# EAGLE design cpu-68008 (EAGLE 9.4.2)

## Sheet 1 of 3: CPU, RAM, ROM
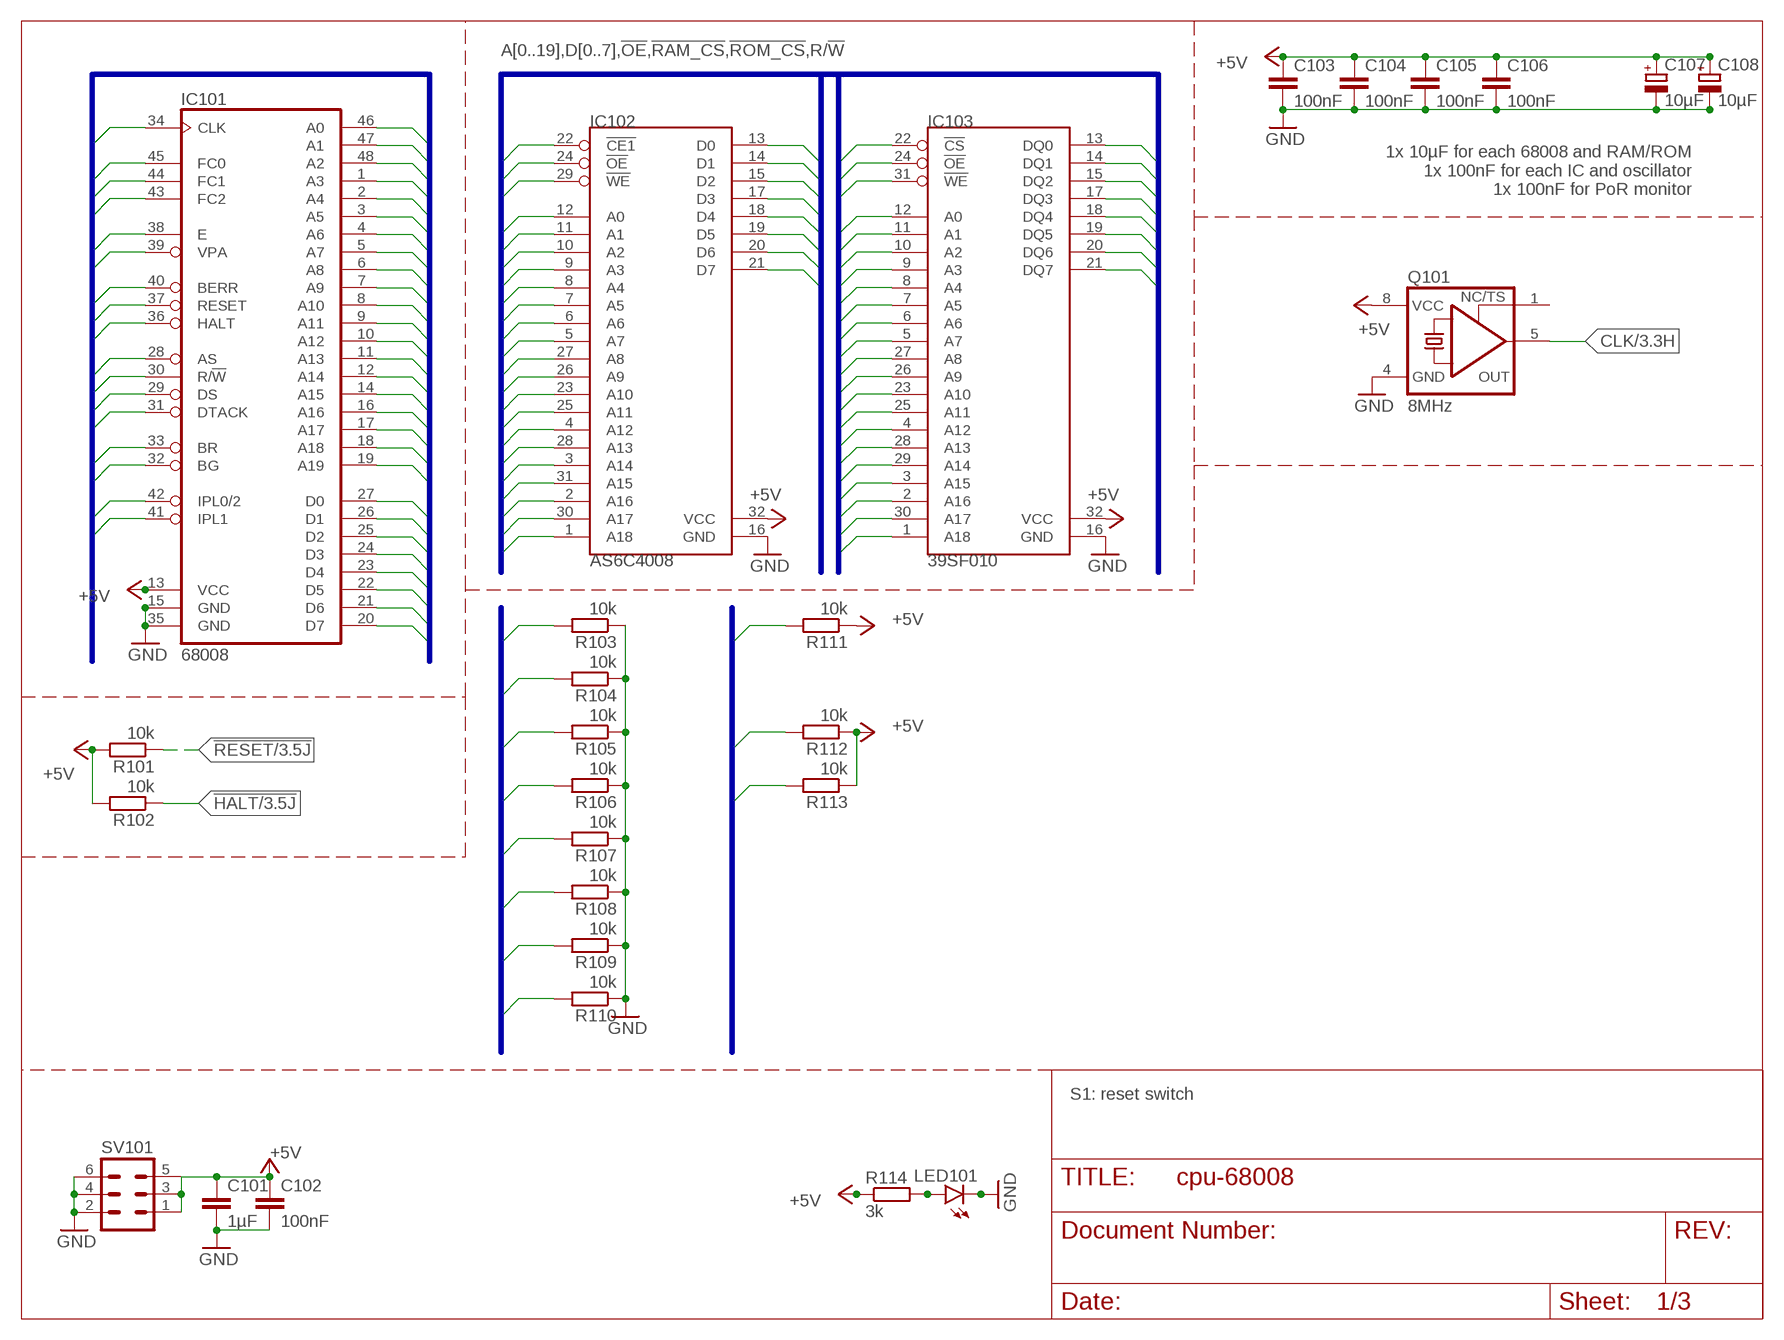
[diagram p0: schematic, sheet 1]

### Parts
C101  1µF  C-EUC0805  [C0805]
C102  100nF  C-EUC0805  [C0805]
C103  100nF  C-EUC0805  [C0805]
C104  100nF  C-EUC0805  [C0805]
C105  100nF  C-EUC0805  [C0805]
C106  100nF  C-EUC0805  [C0805]
C107  10µF  CPOL-EUSMCB  [SMC_B]
C108  10µF  CPOL-EUSMCB  [SMC_B]
IC101  68008  MC68008P  [DIL48]
IC102  AS6C4008  [DIL32]
IC103  39SF010  SST39SF0X0PDIP32  [DIL32]
LED101  LEDCHIPLED_1206  [CHIPLED_1206]
Q101  8MHz  XO-8  [DIL08S]
R101  10k  R-EU_R2012  [R2012]
R102  10k  R-EU_R2012  [R2012]
R103  10k  R-EU_R2012  [R2012]
R104  10k  R-EU_R2012  [R2012]
R105  10k  R-EU_R2012  [R2012]
R106  10k  R-EU_R2012  [R2012]
R107  10k  R-EU_R2012  [R2012]
R108  10k  R-EU_R2012  [R2012]
R109  10k  R-EU_R2012  [R2012]
R110  10k  R-EU_R2012  [R2012]
R111  10k  R-EU_R2012  [R2012]
R112  10k  R-EU_R2012  [R2012]
R113  10k  R-EU_R2012  [R2012]
R114  3k  R-EU_R2012  [R2012]
SV101  MA03-2  [MA03-2]

### Nets
!AS: IC101.28(AS) ; also sheet 2,3
!BERR: IC101.40(BERR) R113.2 ; also sheet 2,3
!BG: IC101.32(BG) ; also sheet 2
!BR: IC101.33(BR) R111.2 ; also sheet 2
!DS: IC101.29(DS) ; also sheet 2
!DTACK: IC101.31(DTACK) ; also sheet 2,3
!HALT: IC101.36(HALT) R102.1 ; also sheet 2,3
!IPL0/2: IC101.42(IPL0/2) ; also sheet 3
!IPL1: IC101.41(IPL1) ; also sheet 3
!OE: IC102.24(!OE) IC103.24(!OE) ; also sheet 2,3
!RAM_CS: IC102.22(!CE1) ; also sheet 3
!RESET: IC101.37(RESET) R101.1 ; also sheet 2,3
!ROM_CS: IC103.22(!CS) ; also sheet 3
!VPA: IC101.39(VPA) R112.2 ; also sheet 2,3
+5V: C101.1 C102.1 C103.1 C104.1 C105.1 C106.1 C107.+ C108.+ IC101.13(VCC) IC102.32(VCC) IC103.32(VCC) Q101.8(VCC) R101.2 R102.2 R111.1 R112.1 R113.1 R114.1 SV101.1 SV101.3 SV101.5 ; also sheet 2,3
A0: IC101.46(A0) IC102.12(A0) IC103.12(A0) ; also sheet 2
A1: IC101.47(A1) IC102.11(A1) IC103.11(A1) ; also sheet 2
A2: IC101.48(A2) IC102.10(A2) IC103.10(A2) ; also sheet 2
A3: IC101.1(A3) IC102.9(A3) IC103.9(A3) ; also sheet 2
A4: IC101.2(A4) IC102.8(A4) IC103.8(A4) ; also sheet 2
A5: IC101.3(A5) IC102.7(A5) IC103.7(A5) ; also sheet 2
A6: IC101.4(A6) IC102.6(A6) IC103.6(A6) ; also sheet 2
A7: IC101.5(A7) IC102.5(A7) IC103.5(A7) ; also sheet 2
A8: IC101.6(A8) IC102.27(A8) IC103.27(A8) ; also sheet 2
A9: IC101.7(A9) IC102.26(A9) IC103.26(A9) ; also sheet 2
A10: IC101.8(A10) IC102.23(A10) IC103.23(A10) ; also sheet 2
A11: IC101.9(A11) IC102.25(A11) IC103.25(A11) ; also sheet 2
A12: IC101.10(A12) IC102.4(A12) IC103.4(A12) ; also sheet 2
A13: IC101.11(A13) IC102.28(A13) IC103.28(A13) ; also sheet 2
A14: IC101.12(A14) IC102.3(A14) IC103.29(A14) ; also sheet 2
A15: IC101.14(A15) IC102.31(A15) IC103.3(A15) ; also sheet 2,3
A16: IC101.16(A16) IC102.2(A16) IC103.2(A16) ; also sheet 2,3
A17: IC101.17(A17) IC102.30(A17) IC103.30(A17) ; also sheet 2,3
A18: IC101.18(A18) IC102.1(A18) IC103.1(A18) ; also sheet 2,3
A19: IC101.19(A19) ; also sheet 2,3
CLK: IC101.34(CLK) Q101.5(OUT) ; also sheet 2,3
D0: IC101.27(D0) IC102.13(D0) IC103.13(DQ0) R103.2 ; also sheet 2
D1: IC101.26(D1) IC102.14(D1) IC103.14(DQ1) R104.2 ; also sheet 2
D2: IC101.25(D2) IC102.15(D2) IC103.15(DQ2) R105.2 ; also sheet 2
D3: IC101.24(D3) IC102.17(D3) IC103.17(DQ3) R106.2 ; also sheet 2
D4: IC101.23(D4) IC102.18(D4) IC103.18(DQ4) R107.2 ; also sheet 2
D5: IC101.22(D5) IC102.19(D5) IC103.19(DQ5) R108.2 ; also sheet 2
D6: IC101.21(D6) IC102.20(D6) IC103.20(DQ6) R109.2 ; also sheet 2
D7: IC101.20(D7) IC102.21(D7) IC103.21(DQ7) R110.2 ; also sheet 2
E: IC101.38(E) ; also sheet 2,3
FC0: IC101.45(FC0) ; also sheet 2,3
FC1: IC101.44(FC1) ; also sheet 2,3
FC2: IC101.43(FC2) ; also sheet 2,3
GND: C101.2 C102.2 C103.2 C104.2 C105.2 C106.2 C107.- C108.- IC101.15(GND) IC101.35(GND) IC102.16(GND) IC103.16(GND) LED101.C Q101.4(GND) R103.1 R104.1 R105.1 R106.1 R107.1 R108.1 R109.1 R110.1 SV101.2 SV101.4 SV101.6 ; also sheet 2,3
N$4: LED101.A R114.2
R/!W!: IC101.30(R/!W) IC102.29(!WE) IC103.31(!WE) ; also sheet 2,3
Unconnected: Q101.1(TS)

### Buses
A[0..19],!AS,!BERR,!BG,!BR,CLK,D[0..7],!DS,!DTACK,E,FC[0..2],!HALT,!IPL0/2,!IPL1,!RESET,R/!W!,!VPA
A[0..19],D[0..7],!OE,!RAM_CS,!ROM_CS,R/!W!
D[0..7]
!BERR,!BG,!BR,!VPA

### Notes on the sheet
- 1x 10µF for each 68008 and RAM/ROM
  1x 100nF for each IC and oscillator
  1x 100nF for PoR monitor
- S1: reset switch

## Sheet 2 of 3: UART, RTC, GPIO, External Bus
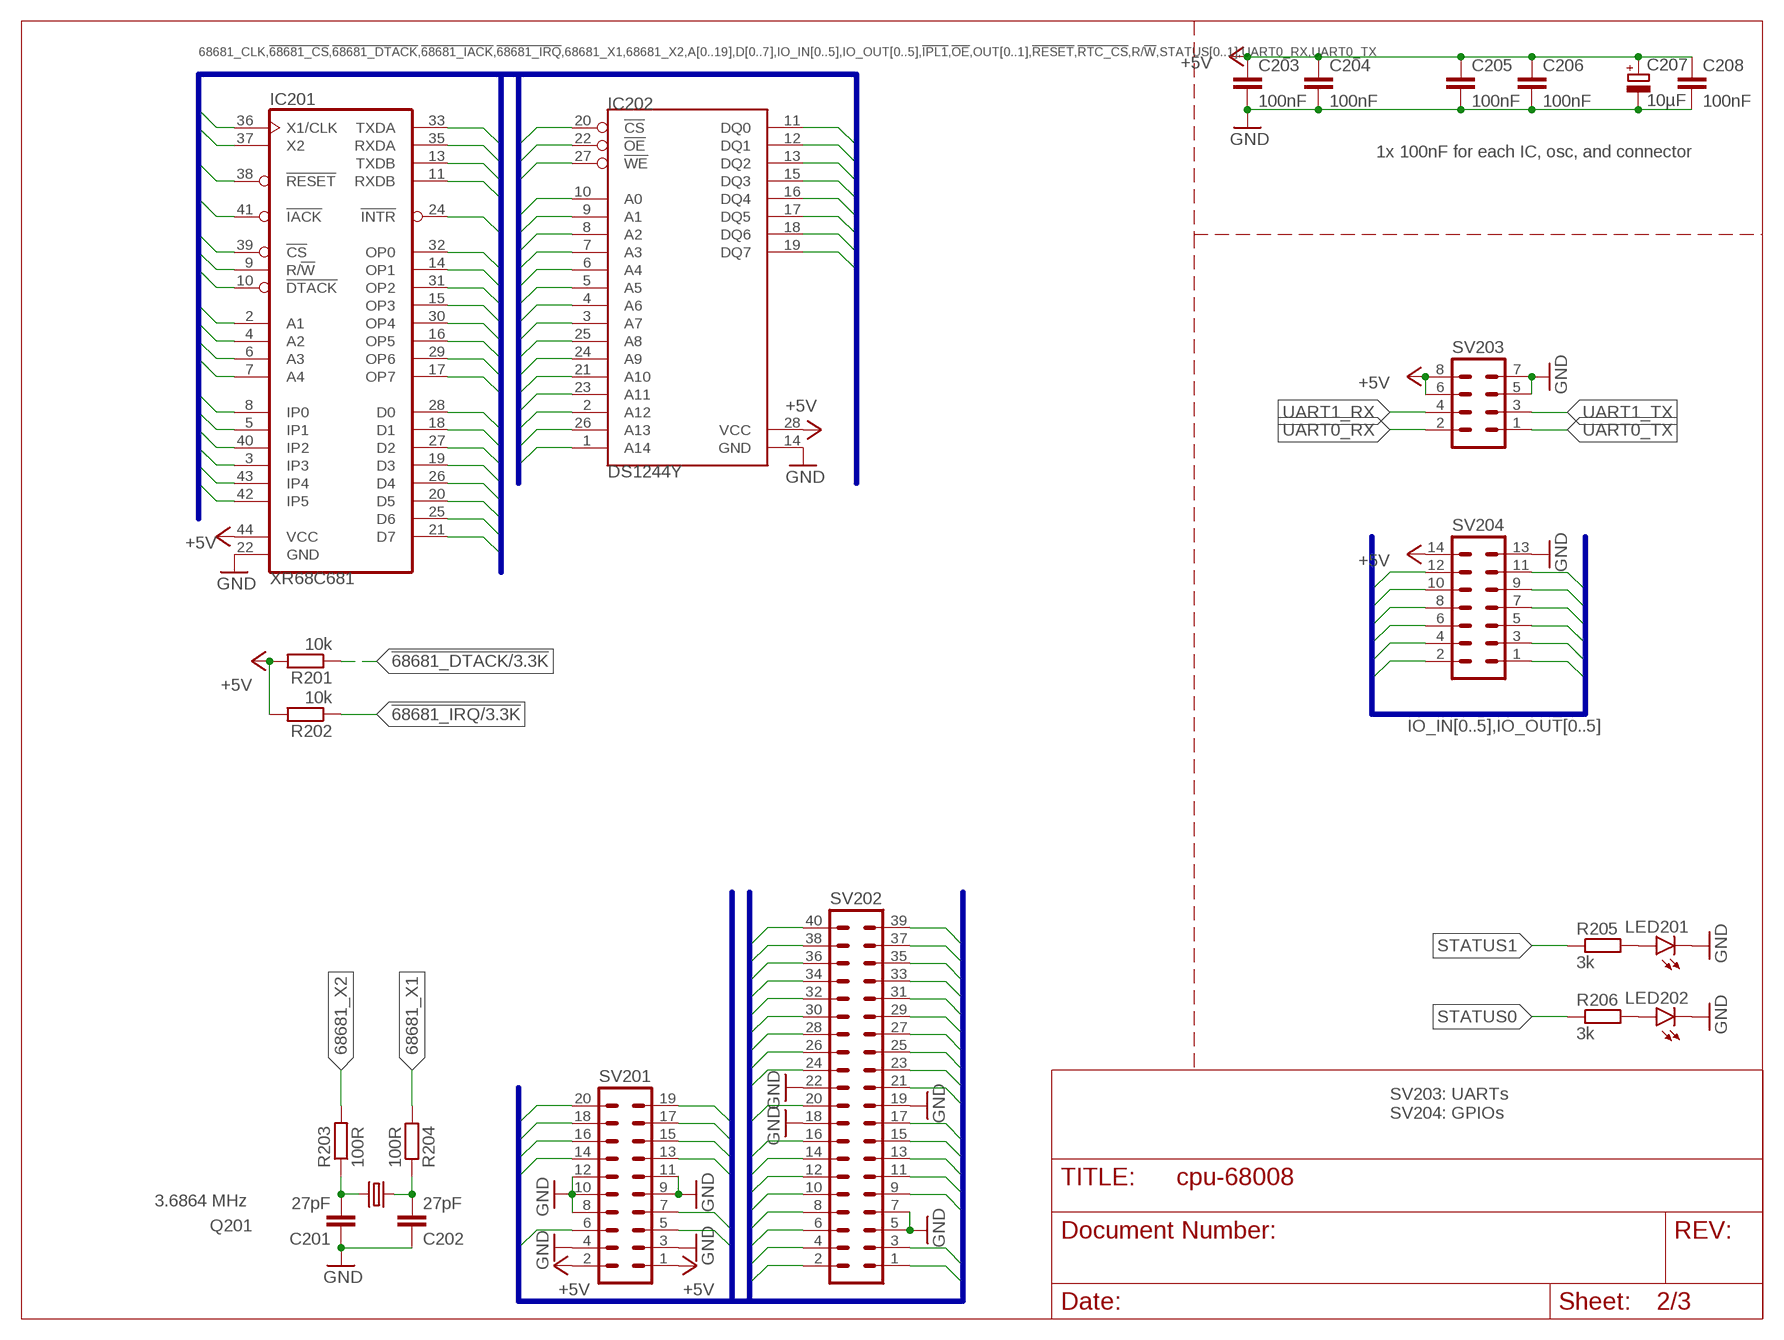
[diagram p1: schematic, sheet 2]

### Parts
C201  27pF  C-EUC0805  [C0805]
C202  27pF  C-EUC0805  [C0805]
C203  100nF  C-EUC0805  [C0805]
C204  100nF  C-EUC0805  [C0805]
C205  100nF  C-EUC0805  [C0805]
C206  100nF  C-EUC0805  [C0805]
C207  10µF  CPOL-EUSMCB  [SMC_B]
C208  100nF  C-EUC0805  [C0805]
IC201  XR68C681  MC68681PLCC44-SOCKET  [PLCC-S44]
IC202  DS1244Y  DS1244EDIP-28  [DIL28-6]
LED201  LEDCHIPLED_1206  [CHIPLED_1206]
LED202  LEDCHIPLED_1206  [CHIPLED_1206]
Q201  3.6864 MHz  CRYSTALHC49S  [HC49/S]
R201  10k  R-EU_R2012  [R2012]
R202  10k  R-EU_R2012  [R2012]
R203  100R  R-EU_R2012  [R2012]
R204  100R  R-EU_R2012  [R2012]
R205  3k  R-EU_R2012  [R2012]
R206  3k  R-EU_R2012  [R2012]
SV201  MA10-2W  [MA10-2W]
SV202  MA20-2W  [MA20-2W]
SV203  MA04-2  [MA04-2]
SV204  MA07-2  [MA07-2]

### Nets
68681_X1: IC201.36(X1/CLK) R204.2
68681_X2: IC201.37(X2) R203.2
!68681_CS: IC201.39(!CS) ; also sheet 3
!68681_DTACK: IC201.10(!DTACK) R201.1 ; also sheet 3
!68681_IACK: IC201.41(!IACK) ; also sheet 3
!68681_IRQ: IC201.24(!INTR) R202.1 ; also sheet 3
!AS: SV202.33 ; also sheet 1,3
!BERR: SV202.9 ; also sheet 1,3
!BG: SV202.25 ; also sheet 1
!BR: SV202.23 ; also sheet 1
!BUS_CS: SV201.7 ; also sheet 3
!BUS_DTACK: SV201.6 ; also sheet 3
!BUS_IRQ: SV201.5 ; also sheet 3
!DS: SV202.31 ; also sheet 1
!DTACK: SV202.27 ; also sheet 1,3
!HALT: SV202.17 ; also sheet 1,3
!OE: IC202.22(!OE) ; also sheet 1,3
!RESET: IC201.38(!RESET) SV202.15 ; also sheet 1,3
!RTC_CS: IC202.20(!CS) ; also sheet 3
!VPA: SV202.11 ; also sheet 1,3
+5V: C203.1 C204.1 C205.1 C206.1 C207.+ C208.1 IC201.44(VCC) IC202.28(VCC) R201.2 R202.2 SV201.1 SV201.2 SV203.6 SV203.8 SV204.14 ; also sheet 1,3
A0: IC201.2(A1) IC202.10(A0) SV201.17 ; also sheet 1
A1: IC201.4(A2) IC202.9(A1) SV201.15 ; also sheet 1
A2: IC201.6(A3) IC202.8(A2) SV201.13 ; also sheet 1
A3: IC201.7(A4) IC202.7(A3) SV201.14 ; also sheet 1
A4: IC202.6(A4) SV201.16 ; also sheet 1
A5: IC202.5(A5) SV201.18 ; also sheet 1
A6: IC202.4(A6) SV201.20 ; also sheet 1
A7: IC202.3(A7) SV202.2 ; also sheet 1
A8: IC202.25(A8) SV202.4 ; also sheet 1
A9: IC202.24(A9) SV202.6 ; also sheet 1
A10: IC202.21(A10) SV202.8 ; also sheet 1
A11: IC202.23(A11) SV202.10 ; also sheet 1
A12: IC202.2(A12) SV202.12 ; also sheet 1
A13: IC202.26(A13) SV202.14 ; also sheet 1
A14: IC202.1(A14) SV202.16 ; also sheet 1
A15: SV202.20 ; also sheet 1,3
A16: SV202.24 ; also sheet 1,3
A17: SV202.26 ; also sheet 1,3
A18: SV202.28 ; also sheet 1,3
A19: SV202.30 ; also sheet 1,3
CLK: SV202.21 ; also sheet 1,3
D0: IC201.28(D0) IC202.11(DQ0) SV202.35 ; also sheet 1
D1: IC201.18(D1) IC202.12(DQ1) SV202.37 ; also sheet 1
D2: IC201.27(D2) IC202.13(DQ2) SV202.39 ; also sheet 1
D3: IC201.19(D3) IC202.15(DQ3) SV202.40 ; also sheet 1
D4: IC201.26(D4) IC202.16(DQ4) SV202.38 ; also sheet 1
D5: IC201.20(D5) IC202.17(DQ5) SV202.36 ; also sheet 1
D6: IC201.25(D6) IC202.18(DQ6) SV202.34 ; also sheet 1
D7: IC201.21(D7) IC202.19(DQ7) SV202.32 ; also sheet 1
E: SV202.13 ; also sheet 1,3
FC0: SV201.19 ; also sheet 1,3
FC1: SV202.1 ; also sheet 1,3
FC2: SV202.3 ; also sheet 1,3
GND: C201.1 C202.1 C203.2 C204.2 C205.2 C206.2 C207.- C208.2 IC201.22(GND) IC202.14(GND) LED201.C LED202.C SV201.3 SV201.4 SV201.8 SV201.9 SV201.10 SV201.11 SV201.12 SV202.5 SV202.7 SV202.18 SV202.19 SV202.22 SV203.5 SV203.7 SV204.13 ; also sheet 1,3
IO_IN0: IC201.40(IP2) SV204.12
IO_IN1: IC201.42(IP5) SV204.10
IO_IN2: IC201.43(IP4) SV204.8
IO_IN3: IC201.3(IP3) SV204.6
IO_IN4: IC201.5(IP1) SV204.4
IO_IN5: IC201.8(IP0) SV204.2
IO_OUT0: IC201.31(OP2) SV204.11
IO_OUT1: IC201.32(OP0) SV204.9
IO_OUT2: IC201.29(OP6) SV204.7
IO_OUT3: IC201.30(OP4) SV204.5
IO_OUT4: IC201.14(OP1) SV204.3
IO_OUT5: IC201.16(OP5) SV204.1
N$2: C202.2 Q201.1 R204.1
N$3: C201.2 Q201.2 R203.1
N$7: LED201.A R205.2
N$9: LED202.A R206.2
R/!W!: IC201.9(R/!W) IC202.27(!WE) SV202.29 ; also sheet 1,3
STATUS0: IC201.15(OP3) R206.1
STATUS1: IC201.17(OP7) R205.1
UART0_RX: IC201.35(RXDA) SV203.2
UART0_TX: IC201.33(TXDA) SV203.1
UART1_RX: IC201.11(RXDB) SV203.4
UART1_TX: IC201.13(TXDB) SV203.3

### Buses
68681_CLK,!68681_CS,!68681_DTACK,!68681_IACK,!68681_IRQ,68681_X1,68681_X2,A[0..19],D[0..7],IO_IN[0..5],IO_OUT[0..5],!IPL1,!OE,OUT[0..1],!RESET,!RTC_CS,R/!W!,STATUS[0..1],UART0_RX,UART0_TX
IO_IN[0..5],IO_OUT[0..5]
A[0..19],!AS,!BERR,!BG,!BR,!BUS_CS,!BUS_DTACK,!BUS_IRQ,CLK,D[0..7],!DS,!DTACK,E,FC[0..2],!HALT,!RESET,R/!W!,!VPA

### Notes on the sheet
- 1x 100nF for each IC, osc, and connector
- SV203: UARTs
  SV204: GPIOs

## Sheet 3 of 3: the main logic blaz
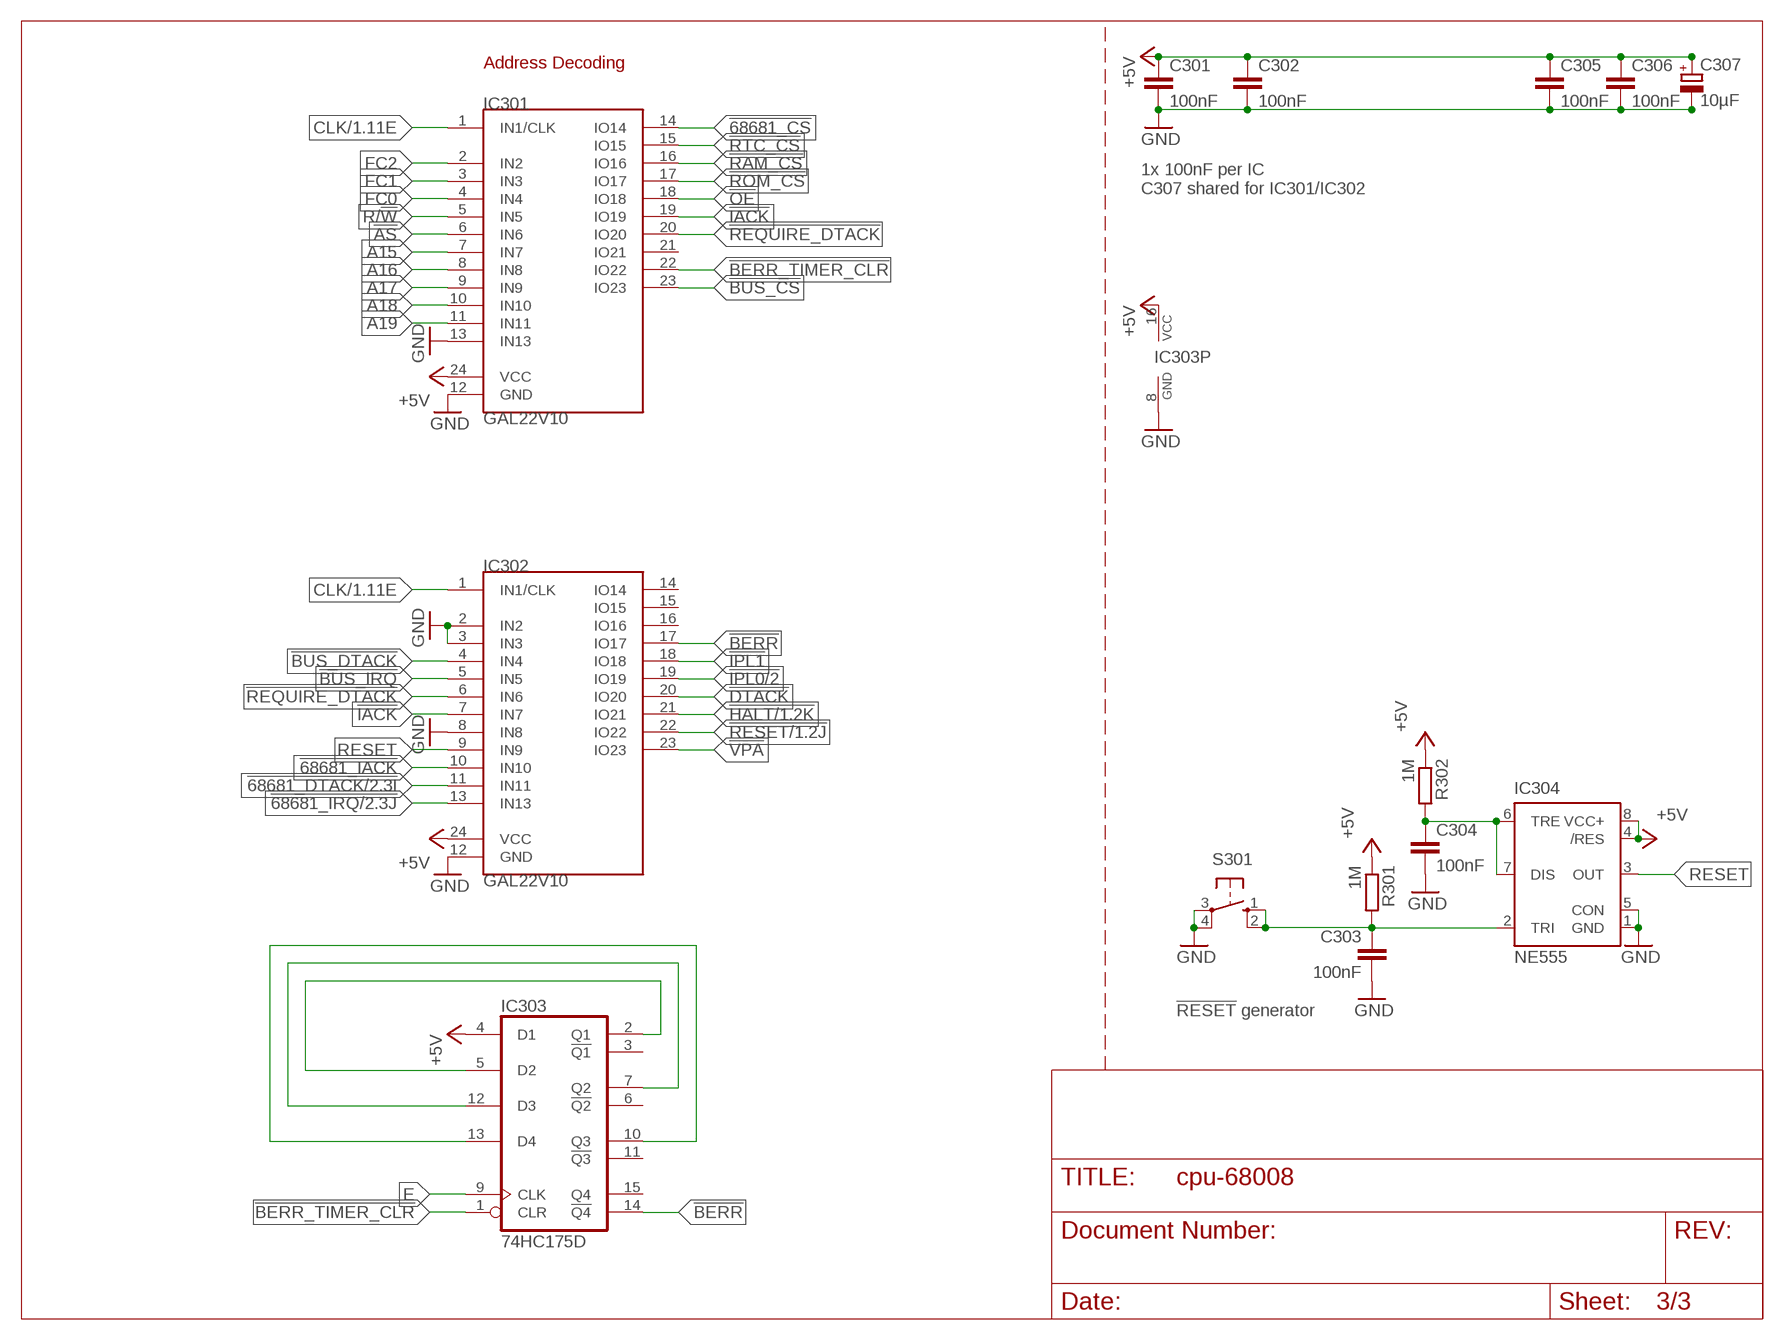
[diagram p2: schematic, sheet 3]

### Parts
C301  100nF  C-EUC0805  [C0805]
C302  100nF  C-EUC0805  [C0805]
C303  100nF  C-EUC0805  [C0805]
C304  100nF  C-EUC0805  [C0805]
C305  100nF  C-EUC0805  [C0805]
C306  100nF  C-EUC0805  [C0805]
C307  10µF  CPOL-EUSMCB  [SMC_B]
IC301  GAL22V10  GAL22V10DIP24  [DIL24S]
IC302  GAL22V10  GAL22V10DIP24  [DIL24S]
IC303  74HC175D  [SO16]
IC304  NE555  [DIL-08]
R301  1M  R-EU_R2012  [R2012]
R302  1M  R-EU_R2012  [R2012]
S301  10-XX  [B3F-10XX]

### Nets
!68681_CS: IC301.14(IO14) ; also sheet 2
!68681_DTACK: IC302.11(IN11) ; also sheet 2
!68681_IACK: IC302.10(IN10) ; also sheet 2
!68681_IRQ: IC302.13(IN13) ; also sheet 2
!AS: IC301.6(IN6) ; also sheet 1,2
!BERR: IC302.17(IO17) IC303.14(!Q4) ; also sheet 1,2
!BERR_TIMER_CLR: IC301.22(IO22) IC303.1(CLR)
!BUS_CS: IC301.23(IO23) ; also sheet 2
!BUS_DTACK: IC302.4(IN4) ; also sheet 2
!BUS_IRQ: IC302.5(IN5) ; also sheet 2
!DTACK: IC302.20(IO20) ; also sheet 1,2
!HALT: IC302.21(IO21) ; also sheet 1,2
!IACK: IC301.19(IO19) IC302.7(IN7)
!IPL0/2: IC302.19(IO19) ; also sheet 1
!IPL1: IC302.18(IO18) ; also sheet 1
!OE: IC301.18(IO18) ; also sheet 1,2
!RAM_CS: IC301.16(IO16) ; also sheet 1
!REQUIRE_DTACK: IC301.20(IO20) IC302.6(IN6)
!RESET: IC302.22(IO22) ; also sheet 1,2
!ROM_CS: IC301.17(IO17) ; also sheet 1
!RTC_CS: IC301.15(IO15) ; also sheet 2
!VPA: IC302.23(IO23) ; also sheet 1,2
+5V: C301.1 C302.1 C305.1 C306.1 C307.+ IC301.24(VCC) IC302.24(VCC) IC303.4(D1) IC303.16(VCC) IC304.4(/RES) IC304.8(VCC+) R301.1 R302.1 ; also sheet 1,2
A15: IC301.7(IN7) ; also sheet 1,2
A16: IC301.8(IN8) ; also sheet 1,2
A17: IC301.9(IN9) ; also sheet 1,2
A18: IC301.10(IN10) ; also sheet 1,2
A19: IC301.11(IN11) ; also sheet 1,2
CLK: IC301.1(IN1/CLK) IC302.1(IN1/CLK) ; also sheet 1,2
E: IC303.9(CLK) ; also sheet 1,2
FC0: IC301.4(IN4) ; also sheet 1,2
FC1: IC301.3(IN3) ; also sheet 1,2
FC2: IC301.2(IN2) ; also sheet 1,2
GND: C301.2 C302.2 C303.2 C304.2 C305.2 C306.2 C307.- IC301.12(GND) IC301.13(IN13) IC302.2(IN2) IC302.3(IN3) IC302.8(IN8) IC302.12(GND) IC303.8(GND) IC304.1(GND) IC304.5(CON) S301.3(P) S301.4(P1) ; also sheet 1,2
N$1: C303.1 IC304.2(TRI) R301.2 S301.1(S) S301.2(S1)
N$5: IC303.2(Q1) IC303.5(D2)
N$6: IC303.7(Q2) IC303.12(D3)
N$8: IC303.10(Q3) IC303.13(D4)
N$12: C304.1 IC304.6(TRE) IC304.7(DIS) R302.2
R/!W!: IC301.5(IN5) ; also sheet 1,2
RESET: IC302.9(IN9) IC304.3(OUT)
Unconnected: IC301.21(IO21) IC302.14(IO14) IC302.15(IO15) IC302.16(IO16) IC303.3(!Q1) IC303.6(!Q2) IC303.11(!Q3) IC303.15(Q4)

### Notes on the sheet
- Address Decoding
- 1x 100nF per IC
  C307 shared for IC301/IC302
- !RESET! generator

## Library data of the parts
C101 = rcl:C-EU: CAPACITOR, European symbol; MOUSER: 710-885012107015; SPICEPREFIX: C
C102-C106 C203-C206 C208 C301-C303 C305 C306 = rcl:C-EU: CAPACITOR, European symbol; MOUSER: 710-885012207072; SPICEPREFIX: C
C107 C108 C207 C307 = rcl:CPOL-EU: POLARIZED CAPACITOR, European symbol; MOUSER: 581-TAJB106K020RNJV; SPICEPREFIX: C
C201 C202 = rcl:C-EU: CAPACITOR, European symbol; MOUSER: 80-C0805C270K5HACTU; SPICEPREFIX: C
C304 = rcl:C-EU: CAPACITOR, European symbol; MOUSER: 710-885012207078; SPICEPREFIX: C
IC101 = 68komputer:MC68008P: 68008 Processor (68000 with 8-bit bus); MOUSER_SOCKET: 517-4848-6004-CP
IC102 = 68komputer:AS6C4008: AS6C4008 – 512K x 8 Low Power SRAM Datasheet <https://www.mouser.com/datasheet/2/12/AS6C4008-1265427.pdf>; MOUSER: 913-AS6C4008-55PCN; MOUSER_SOCKET: 517-4832-6000-CP
IC103 = 68komputer:SST39SF0X0: 1 Mbit / 2 Mbit / 4 Mbit Multi-Purpose Flash Datasheet <http://ww1.microchip.com/downloads/en/DeviceDoc/20005022C.pdf>; MOUSER: 804-39SF010A7CPHE; MOUSER_SOCKET: 517-4832-6000-CP
IC201 = 68komputer:MC68681: MC68681 Dual UART Datasheet <https://www.nxp.com/docs/en/data-sheet/SCC68681.pdf>; MOUSER: 701-XR68C681CJ-F; MOUSER_SOCKET: 940-44-044-24-000000
IC202 = Parts:DS1244: 256k NV SRAM with Phantom Clock Datasheet <https://datasheets.maximintegrated.com/en/ds/DS1244-DS1244P.pdf>; MOUSER: 700-DS1244Y-70; MOUSER_SOCKET: 571-1-2199299-2
IC301 IC302 = 68komputer:GAL22V10: GAL22V10D – Generic Array Logic Datasheet <http://web.mit.edu/6.115/www/document/gal22v10.pdf>
IC303 = 74xx-eu:74*175: Qadruple D type FLIP FLOP, clear
IC304 = st-microelectronics:NE555: General purpose bipolar Timer; MF: Arrow Electronics; MOUSER: 595-NE555P; MPN: NE555N; OC_FARNELL: 1467742; OC_NEWARK: 89K1486
LED101 = led:LED: LED OSRAM: - CHIPLED LG R971, LG N971, LY N971, LG Q971, LY Q971, LO R971, LY R971 LH N974, LH R974 LS Q976, LO Q976, LY Q976 LO Q996 - Hyper CHIPLED LW Q18S LB Q993, LB Q99A, LB R99A - SideLED LS A670, LO A670, LY A670, LG A670, LP A670 LB A673, LV A673, LT A673, LW A673 LH A674 LY A675 LS A676, LA A676, LO A676, LY A676, LW A676 LS A679, LY A679, LG A679 - Hyper Micro SIDELED® LS Y876, LA Y876, LO Y876, LY Y876 LT Y87S - SmartLED LW L88C, LW L88S LB L89C, LB L89S, LG L890 LS L89K, LO L89K, LY L89K LS L896, LA L896, LO L896, LY L896 - TOPLED LS T670, LO T670, LY T670, LG T670, LP T670 LSG T670, LSP T670, LSY T670, LOP T670, LYG T670 LG T671, LOG T671, LSG T671 LB T673, LV T673, LT T673, LW T673 LH T674 LS T676, LA T676, LO T676, LY T676, LB T676, LH T676, LSB T676, LW T676 LB T67C, LV T67C, LT T67C, LS T67K, LO T67K, LY T67K, LW E67C LS E67B, LA E67B, LO E67B, LY E67B, LB E67C, LV E67C, LT E67C LW T67C LS T679, LY T679, LG T679 LS T770, LO T770, LY T770, LG T770, LP T770 LB T773, LV T773, LT T773, LW T773 LH T774 LS E675, LA E675, LY E675, LS T675 LS T776, LA T776, LO T776, LY T776, LB T776 LHGB T686 LT T68C, LB T68C - Hyper Mini TOPLED® LB M676 - Mini TOPLED Santana® LG M470 LS M47K, LO M47K, LY M47K Source: http://www.osram.convergy.de LUXEON: - LUMILED® LXK2-PW12-R00, LXK2-PW12-S00, LXK2-PW14-U00, LXK2-PW14-V00 LXK2-PM12-R00, LXK2-PM12-S00, LXK2-PM14-U00 LXK2-PE12-Q00, LXK2-PE12-R00, LXK2-PE12-S00, LXK2-PE14-T00, LXK2-PE14-U00 LXK2-PB12-K00, LXK2-PB12-L00, LXK2-PB12-M00, LXK2-PB14-N00, LXK2-PB14-P00, LXK2-PB14-Q00 LXK2-PR12-L00, LXK2-PR12-M00, LXK2-PR14-Q00, LXK2-PR14-R00 LXK2-PD12-Q00, LXK2-PD12-R00, LXK2-PD12-S00 LXK2-PH12-R00, LXK2-PH12-S00 LXK2-PL12-P00, LXK2-PL12-Q00, LXK2-PL12-R00 Source: www.luxeon.com KINGBRIGHT: KA-3528ASYC Source: www.kingbright.com; MOUSER: 710-156120YS75300
LED201 LED202 = led:LED: LED OSRAM: - CHIPLED LG R971, LG N971, LY N971, LG Q971, LY Q971, LO R971, LY R971 LH N974, LH R974 LS Q976, LO Q976, LY Q976 LO Q996 - Hyper CHIPLED LW Q18S LB Q993, LB Q99A, LB R99A - SideLED LS A670, LO A670, LY A670, LG A670, LP A670 LB A673, LV A673, LT A673, LW A673 LH A674 LY A675 LS A676, LA A676, LO A676, LY A676, LW A676 LS A679, LY A679, LG A679 - Hyper Micro SIDELED® LS Y876, LA Y876, LO Y876, LY Y876 LT Y87S - SmartLED LW L88C, LW L88S LB L89C, LB L89S, LG L890 LS L89K, LO L89K, LY L89K LS L896, LA L896, LO L896, LY L896 - TOPLED LS T670, LO T670, LY T670, LG T670, LP T670 LSG T670, LSP T670, LSY T670, LOP T670, LYG T670 LG T671, LOG T671, LSG T671 LB T673, LV T673, LT T673, LW T673 LH T674 LS T676, LA T676, LO T676, LY T676, LB T676, LH T676, LSB T676, LW T676 LB T67C, LV T67C, LT T67C, LS T67K, LO T67K, LY T67K, LW E67C LS E67B, LA E67B, LO E67B, LY E67B, LB E67C, LV E67C, LT E67C LW T67C LS T679, LY T679, LG T679 LS T770, LO T770, LY T770, LG T770, LP T770 LB T773, LV T773, LT T773, LW T773 LH T774 LS E675, LA E675, LY E675, LS T675 LS T776, LA T776, LO T776, LY T776, LB T776 LHGB T686 LT T68C, LB T68C - Hyper Mini TOPLED® LB M676 - Mini TOPLED Santana® LG M470 LS M47K, LO M47K, LY M47K Source: http://www.osram.convergy.de LUXEON: - LUMILED® LXK2-PW12-R00, LXK2-PW12-S00, LXK2-PW14-U00, LXK2-PW14-V00 LXK2-PM12-R00, LXK2-PM12-S00, LXK2-PM14-U00 LXK2-PE12-Q00, LXK2-PE12-R00, LXK2-PE12-S00, LXK2-PE14-T00, LXK2-PE14-U00 LXK2-PB12-K00, LXK2-PB12-L00, LXK2-PB12-M00, LXK2-PB14-N00, LXK2-PB14-P00, LXK2-PB14-Q00 LXK2-PR12-L00, LXK2-PR12-M00, LXK2-PR14-Q00, LXK2-PR14-R00 LXK2-PD12-Q00, LXK2-PD12-R00, LXK2-PD12-S00 LXK2-PH12-R00, LXK2-PH12-S00 LXK2-PL12-P00, LXK2-PL12-Q00, LXK2-PL12-R00 Source: www.luxeon.com KINGBRIGHT: KA-3528ASYC Source: www.kingbright.com; MOUSER: 710-156120VS75300
Q101 = crystal:XO-: CRYSTAL; MOUSER: 774-MXO45HS-3C-8.0; MOUSER_SOCKET: 535-1108800; OC_FARNELL: unknown; OC_NEWARK: unknown
Q201 = crystal:CRYSTAL: CRYSTAL; MOUSER: 815-ABL-3.6864-B2; OC_FARNELL: 1667008; OC_NEWARK: unknown
R101-R113 R201 R202 = rcl:R-EU_: RESISTOR, European symbol; MOUSER: 652-CR0805FX-1002ELF; SPICEPREFIX: R
R114 R205 R206 = rcl:R-EU_: RESISTOR, European symbol; MOUSER: 652-CR0805JW-302ELF; SPICEPREFIX: R
R203 R204 = rcl:R-EU_: RESISTOR, European symbol; MOUSER: 652-CR0805FX-1000ELF; SPICEPREFIX: R
R301 R302 = rcl:R-EU_: RESISTOR, European symbol; MOUSER: 652-CR0805FX-18R2ELF; SPICEPREFIX: R
S301 = switch-omron:10-XX: OMRON SWITCH; MOUSER: 653-B3F-1052; MPN: B3F-1000; OC_FARNELL: 176432; OC_NEWARK: 36M3542
SV101 = con-lstb:MA03-2: PIN HEADER; OC_FARNELL: unknown; OC_NEWARK: unknown
SV201 = con-lstb:MA10-2W: PIN HEADER; OC_FARNELL: unknown; OC_NEWARK: unknown
SV202 = con-lstb:MA20-2W: PIN HEADER; OC_FARNELL: unknown; OC_NEWARK: unknown
SV203 = con-lstb:MA04-2: PIN HEADER; OC_FARNELL: unknown; OC_NEWARK: unknown
SV204 = con-lstb:MA07-2: PIN HEADER; OC_FARNELL: unknown; OC_NEWARK: unknown

## Net classes
0 default: width 0.203 mm

## Board
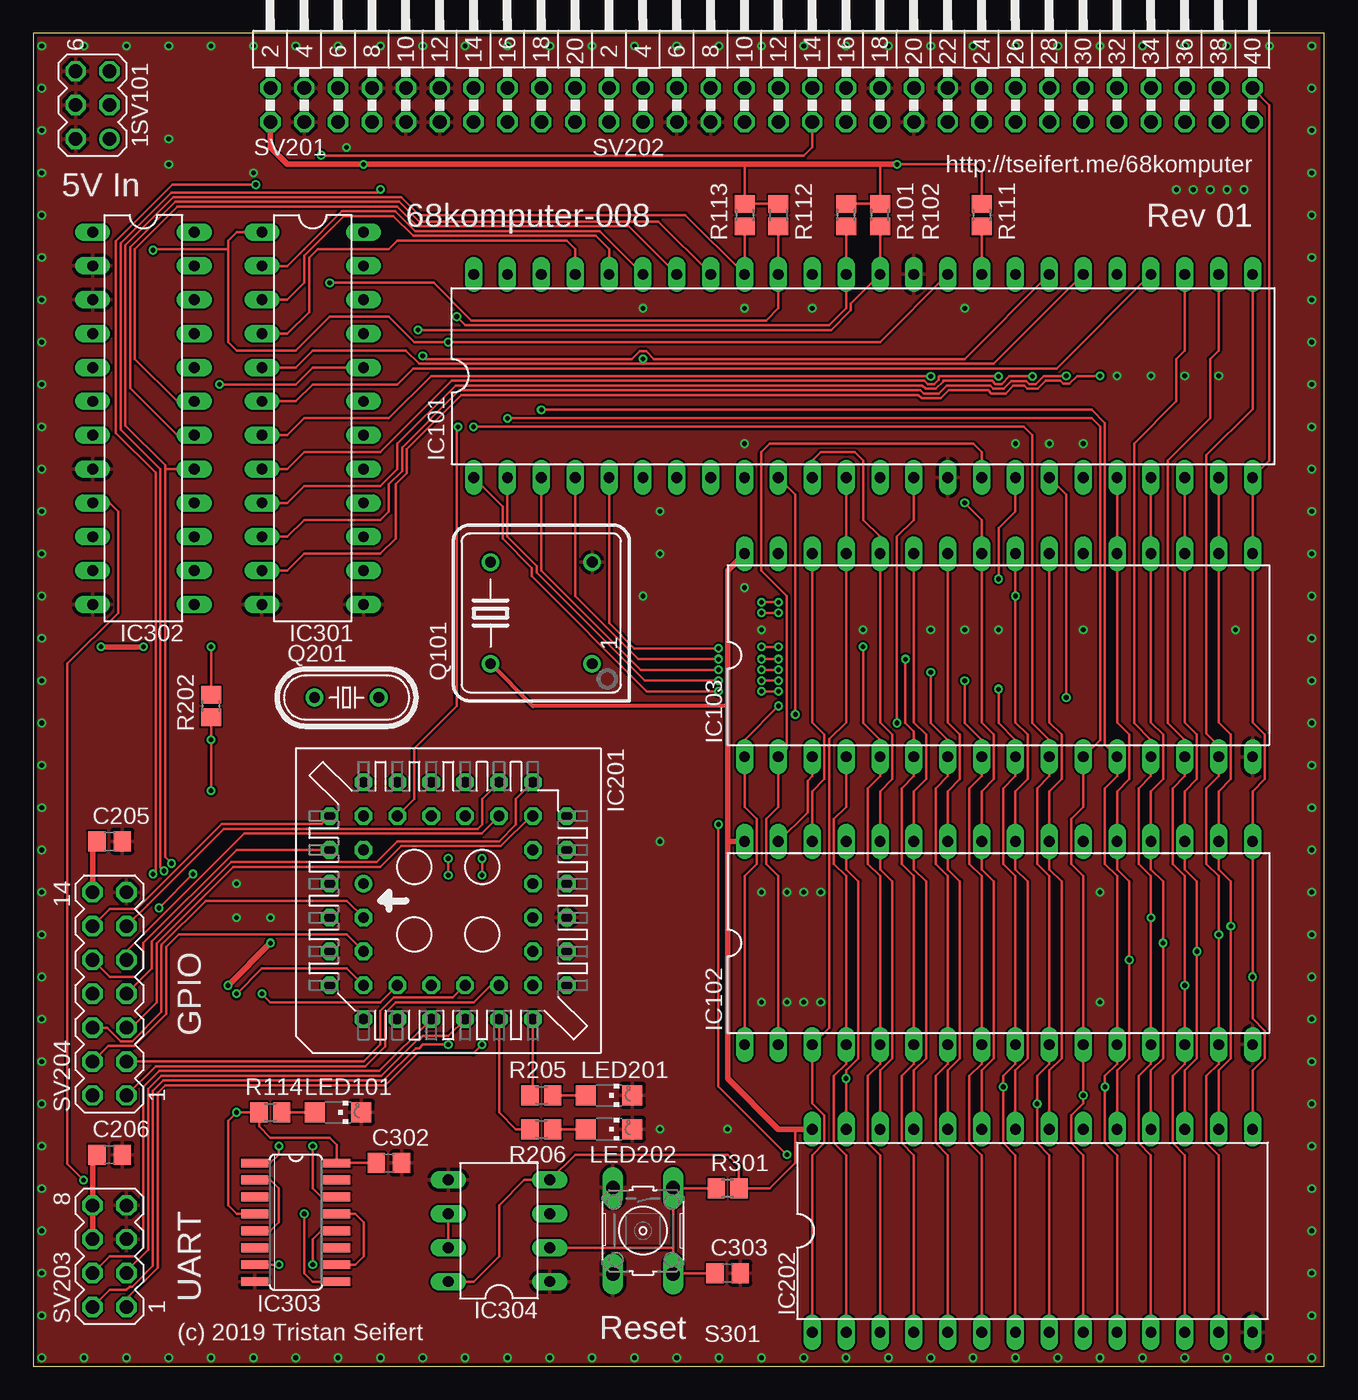
[diagram p3: board, top side]
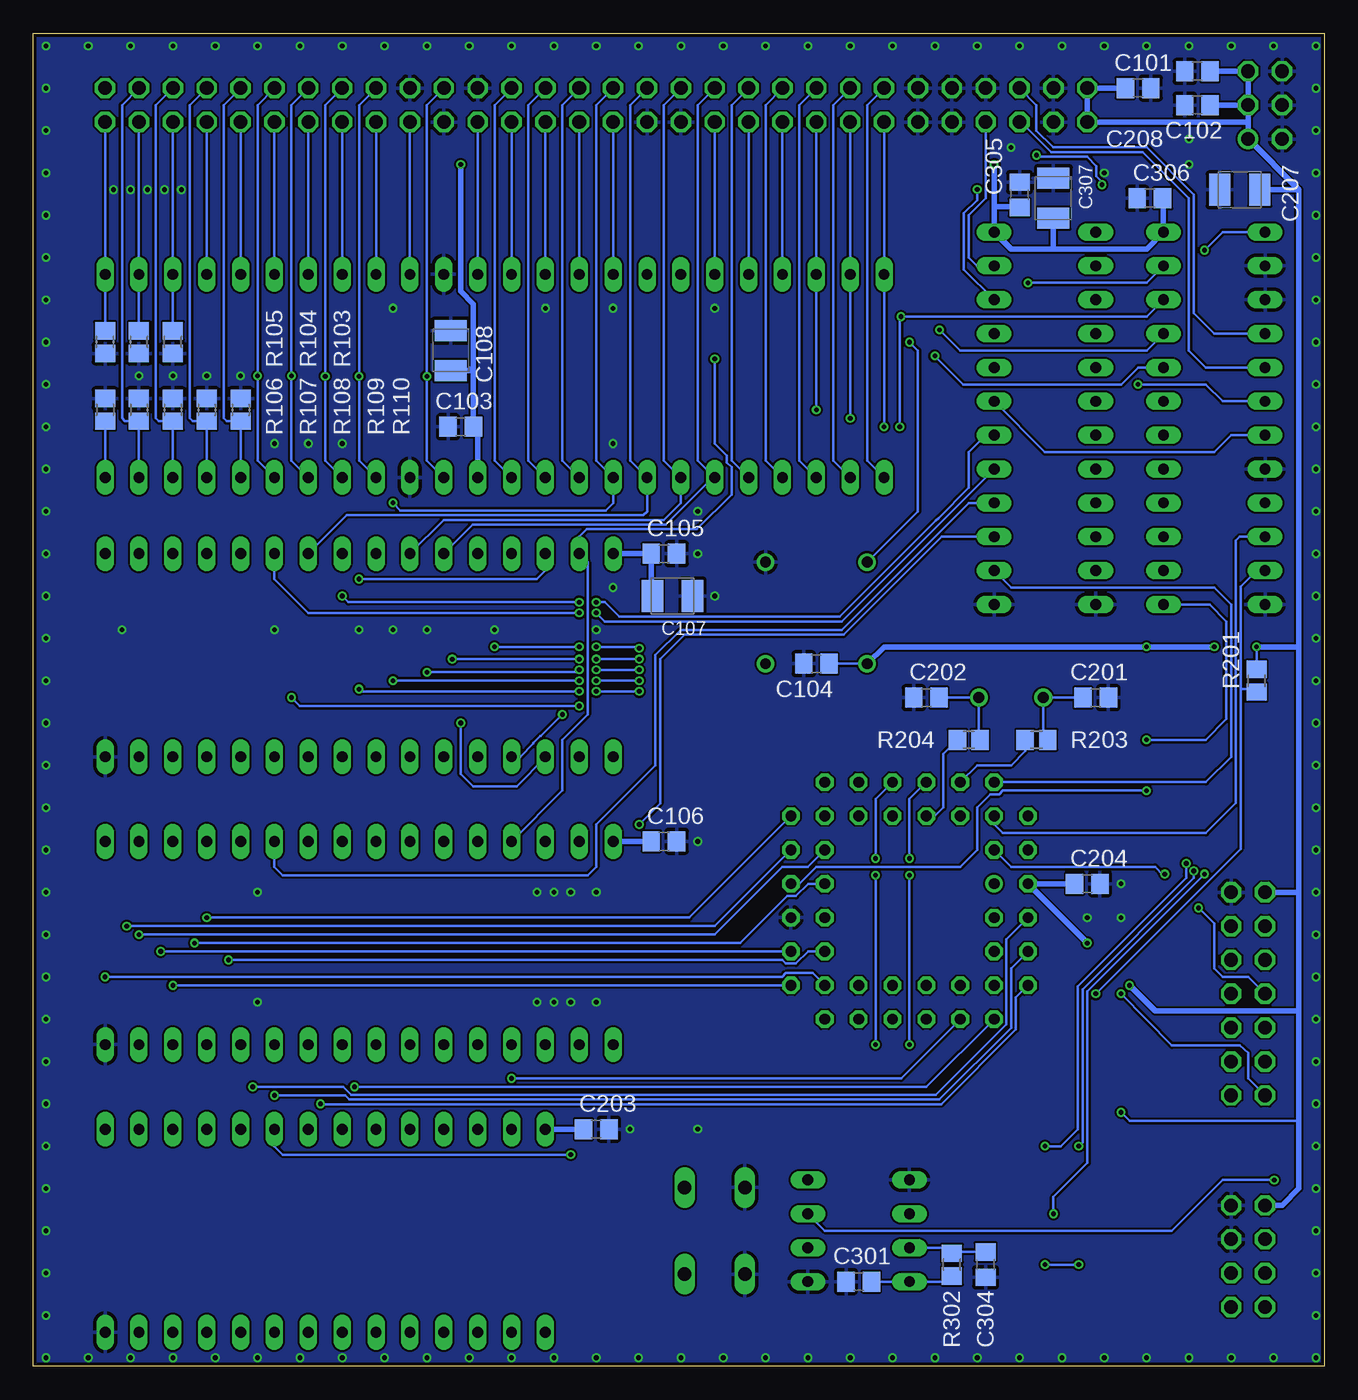
[diagram p4: board, bottom side, seen from below]

Size 96.83 x 100 mm. Coordinates in mm from the lower left corner, seen from the top.
Outline: 0,0 96.83,0 96.83,100 0,100 0,0
Copper layers (1*16): Top 0.035mm / dielectric 1.5mm / Bottom 0.035mm
Design rules "dirt_cheap_dirty_boards.v1.1": minimum track width 6mil, minimum drill 12mil, track to track 6mil, track to pad 6mil, pad to pad 6mil, via to via 6mil, smd to smd 0mil, copper to edge 10mil, drill to drill 10mil, minimum pad ring 10mil, minimum via ring 6mil, stop-mask expansion 2mil, vias tented up to drill 25mil, thermal gap 10mil

### Footprints (pad centres in the part's own frame; a part is rotated, then mirrored left to right if it is on the bottom)
C0805 = smd 1.3 x 1.5: 1 -0.95,0; 2 0.95,0
SMC_B = smd 1.6 x 2.4: + -1.5,0; - 1.5,0
DIL48 = drill 0.813 long: 1 -29.21,-7.62; 2 -26.67,-7.62; 3 -24.13,-7.62; 4 -21.59,-7.62; 5 -19.05,-7.62; 6 -16.51,-7.62; 7 -13.97,-7.62; 8 -11.43,-7.62; 9 -8.89,-7.62; 10 -6.35,-7.62; 11 -3.81,-7.62; 12 -1.27,-7.62; 13 1.27,-7.62; 14 3.81,-7.62; 15 6.35,-7.62; 16 8.89,-7.62; 17 11.43,-7.62; 18 13.97,-7.62; 19 16.51,-7.62; 20 19.05,-7.62; 21 21.59,-7.62; 22 24.13,-7.62; 23 26.67,-7.62; 24 29.21,-7.62; 25 29.21,7.62; 26 26.67,7.62; 27 24.13,7.62; 28 21.59,7.62; 29 19.05,7.62; 30 16.51,7.62; 31 13.97,7.62; 32 11.43,7.62; 33 8.89,7.62; 34 6.35,7.62; 35 3.81,7.62; 36 1.27,7.62; 37 -1.27,7.62; 38 -3.81,7.62; 39 -6.35,7.62; 40 -8.89,7.62; 41 -11.43,7.62; 42 -13.97,7.62; 43 -16.51,7.62; 44 -19.05,7.62; 45 -21.59,7.62; 46 -24.13,7.62; 47 -26.67,7.62; 48 -29.21,7.62
DIL32 = drill 0.813 long: 1 -19.05,-7.62; 2 -16.51,-7.62; 3 -13.97,-7.62; 4 -11.43,-7.62; 5 -8.89,-7.62; 6 -6.35,-7.62; 7 -3.81,-7.62; 8 -1.27,-7.62; 9 1.27,-7.62; 10 3.81,-7.62; 11 6.35,-7.62; 12 8.89,-7.62; 13 11.43,-7.62; 14 13.97,-7.62; 15 16.51,-7.62; 16 19.05,-7.62; 17 19.05,7.62; 18 16.51,7.62; 19 13.97,7.62; 20 11.43,7.62; 21 8.89,7.62; 22 6.35,7.62; 23 3.81,7.62; 24 1.27,7.62; 25 -1.27,7.62; 26 -3.81,7.62; 27 -6.35,7.62; 28 -8.89,7.62; 29 -11.43,7.62; 30 -13.97,7.62; 31 -16.51,7.62; 32 -19.05,7.62
PLCC-S44 = drill 0.813: 1 1.27,6.35 | drill 0.813 octagon: 2 -1.27,8.89; 3 -1.27,6.35; 4 -3.81,8.89; 5 -3.81,6.35; 6 -6.35,8.89; 7 -8.89,6.35; 8 -6.35,6.35; 9 -8.89,3.81; 10 -6.35,3.81; 11 -8.89,1.27; 12 -6.35,1.27; 13 -8.89,-1.27; 14 -6.35,-1.27; 15 -8.89,-3.81; 16 -6.35,-3.81; 17 -8.89,-6.35; 18 -6.35,-8.89; 19 -6.35,-6.35; 20 -3.81,-8.89; 21 -3.81,-6.35; 22 -1.27,-8.89; 23 -1.27,-6.35; 24 1.27,-8.89; 25 1.27,-6.35; 26 3.81,-8.89; 27 3.81,-6.35; 28 6.35,-8.89; 29 8.89,-6.35; 30 6.35,-6.35; 31 8.89,-3.81; 32 6.35,-3.81; 33 8.89,-1.27; 34 6.35,-1.27; 35 8.89,1.27; 36 6.35,1.27; 37 8.89,3.81; 38 6.35,3.81; 39 8.89,6.35; 40 6.35,8.89; 41 6.35,6.35; 42 3.81,8.89; 43 3.81,6.35; 44 1.27,8.89
DIL28-6 = drill 0.813 long: 1 -16.51,-7.62; 2 -13.97,-7.62; 3 -11.43,-7.62; 4 -8.89,-7.62; 5 -6.35,-7.62; 6 -3.81,-7.62; 7 -1.27,-7.62; 8 1.27,-7.62; 9 3.81,-7.62; 10 6.35,-7.62; 11 8.89,-7.62; 12 11.43,-7.62; 13 13.97,-7.62; 14 16.51,-7.62; 15 16.51,7.62; 16 13.97,7.62; 17 11.43,7.62; 18 8.89,7.62; 19 6.35,7.62; 20 3.81,7.62; 21 1.27,7.62; 22 -1.27,7.62; 23 -3.81,7.62; 24 -6.35,7.62; 25 -8.89,7.62; 26 -11.43,7.62; 27 -13.97,7.62; 28 -16.51,7.62
DIL24S = drill 0.813 long: 1 -13.97,-3.81; 2 -11.43,-3.81; 3 -8.89,-3.81; 4 -6.35,-3.81; 5 -3.81,-3.81; 6 -1.27,-3.81; 7 1.27,-3.81; 8 3.81,-3.81; 9 6.35,-3.81; 10 8.89,-3.81; 11 11.43,-3.81; 12 13.97,-3.81; 13 13.97,3.81; 14 11.43,3.81; 15 8.89,3.81; 16 6.35,3.81; 17 3.81,3.81; 18 1.27,3.81; 19 -1.27,3.81; 20 -3.81,3.81; 21 -6.35,3.81; 22 -8.89,3.81; 23 -11.43,3.81; 24 -13.97,3.81
SO16 = smd 0.66 x 2.032: 1 -4.445,-3.073; 2 -3.175,-3.073; 3 -1.905,-3.073; 4 -0.635,-3.073; 5 0.635,-3.073; 6 1.905,-3.073; 7 3.175,-3.073; 8 4.445,-3.073; 9 4.445,3.073; 10 3.175,3.073; 11 1.905,3.073; 12 0.635,3.073; 13 -0.635,3.073; 14 -1.905,3.073; 15 -3.175,3.073; 16 -4.445,3.073
DIL-08 = drill 0.813 long: 1 -3.81,-3.81; 2 -1.27,-3.81; 3 1.27,-3.81; 4 3.81,-3.81; 5 3.81,3.81; 6 1.27,3.81; 7 -1.27,3.81; 8 -3.81,3.81
CHIPLED_1206 = smd 1.5 x 1.5: A 0,-1.75; C 0,1.75
DIL08S = drill 0.813: 1 -3.81,-3.81; 4 3.81,-3.81; 5 3.81,3.81; 8 -3.81,3.81
HC49/S = drill 0.813: 1 -2.413,0; 2 2.413,0
R2012 = smd 1.3 x 1.5: 1 -0.85,0; 2 0.85,0
B3F-10XX = drill 1.016 long: 1 -3.251,2.261; 2 3.251,2.261; 3 -3.251,-2.261; 4 3.251,-2.261
MA03-2 = drill 1.016: 1 -2.54,-1.27 | drill 1.016 octagon: 2 -2.54,1.27; 3 0,-1.27; 4 0,1.27; 5 2.54,-1.27; 6 2.54,1.27
MA10-2W = drill 1.016 octagon: 1 -11.43,-1.27; 2 -11.43,1.27; 3 -8.89,-1.27; 4 -8.89,1.27; 5 -6.35,-1.27; 6 -6.35,1.27; 7 -3.81,-1.27; 8 -3.81,1.27; 9 -1.27,-1.27; 10 -1.27,1.27; 11 1.27,-1.27; 12 1.27,1.27; 13 3.81,-1.27; 14 3.81,1.27; 15 6.35,-1.27; 16 6.35,1.27; 17 8.89,-1.27; 18 8.89,1.27; 19 11.43,-1.27; 20 11.43,1.27
MA20-2W = drill 1.016 octagon: 1 -24.13,-1.27; 2 -24.13,1.27; 3 -21.59,-1.27; 4 -21.59,1.27; 5 -19.05,-1.27; 6 -19.05,1.27; 7 -16.51,-1.27; 8 -16.51,1.27; 9 -13.97,-1.27; 10 -13.97,1.27; 11 -11.43,-1.27; 12 -11.43,1.27; 13 -8.89,-1.27; 14 -8.89,1.27; 15 -6.35,-1.27; 16 -6.35,1.27; 17 -3.81,-1.27; 18 -3.81,1.27; 19 -1.27,-1.27; 20 -1.27,1.27; 21 1.27,-1.27; 22 1.27,1.27; 23 3.81,-1.27; 24 3.81,1.27; 25 6.35,-1.27; 26 6.35,1.27; 27 8.89,-1.27; 28 8.89,1.27; 29 11.43,-1.27; 30 11.43,1.27; 31 13.97,-1.27; 32 13.97,1.27; 33 16.51,-1.27; 34 16.51,1.27; 35 19.05,-1.27; 36 19.05,1.27; 37 21.59,-1.27; 38 21.59,1.27; 39 24.13,-1.27; 40 24.13,1.27
MA04-2 = drill 1.016 octagon: 1 -3.81,-1.27; 2 -3.81,1.27; 3 -1.27,-1.27; 4 -1.27,1.27; 5 1.27,-1.27; 6 1.27,1.27; 7 3.81,-1.27; 8 3.81,1.27
MA07-2 = drill 1.016 octagon: 1 -7.62,-1.27; 2 -7.62,1.27; 3 -5.08,-1.27; 4 -5.08,1.27; 5 -2.54,-1.27; 6 -2.54,1.27; 7 0,-1.27; 8 0,1.27; 9 2.54,-1.27; 10 2.54,1.27; 11 5.08,-1.27; 12 5.08,1.27; 13 7.62,-1.27; 14 7.62,1.27

### Placement (x,y rotation side)
C101  9.53,97.16 180 bottom
C102  9.53,94.61 180 bottom
C103  64.77,70.48 180 bottom
C104  38.1,52.7 180 bottom
C105  49.53,60.96 0 bottom
C106  49.53,39.37 0 bottom
C107  48.9,57.78 0 bottom
C108  65.53,76.2 90 bottom
C201  17.14,50.16 180 bottom
C202  29.84,50.16 0 bottom
C203  54.61,17.78 0 bottom
C204  17.78,36.2 0 bottom
C205  5.71,39.37 0 top
C206  5.71,15.88 0 top
C207  6.35,88.27 180 bottom
C208  13.97,95.89 0 bottom
C301  34.92,6.35 180 bottom
C302  26.67,15.24 0 top
C303  52.07,6.99 0 top
C304  25.4,7.62 270 bottom
C305  22.86,87.88 90 bottom
C306  13.08,87.63 180 bottom
C307  20.32,87.63 90 bottom
IC101  62.23,74.3 0 top
IC102  72.39,31.75 0 top
IC103  72.39,53.34 0 top
IC201  31.11,34.92 90 top
IC202  74.93,10.16 0 top
IC301  20.95,71.12 270 top
IC302  8.26,71.12 270 top
IC303  19.68,10.79 270 top
IC304  34.92,10.16 90 top
LED101  22.86,19.05 270 top
LED201  43.18,20.32 270 top
LED202  43.18,17.78 270 top
Q101  38.1,56.52 90 top
Q201  23.5,50.16 180 top
R101  60.96,86.36 90 top
R102  63.5,86.36 90 top
R103  86.36,76.83 90 bottom
R104  88.9,76.83 90 bottom
R105  91.44,76.83 90 bottom
R106  91.44,71.75 270 bottom
R107  88.9,71.75 270 bottom
R108  86.36,71.75 270 bottom
R109  83.82,71.75 270 bottom
R110  81.28,71.75 270 bottom
R111  71.12,86.36 270 top
R112  55.88,86.36 270 top
R113  53.34,86.36 270 top
R114  17.78,19.05 0 top
R201  5.08,51.44 90 bottom
R202  13.34,49.53 90 top
R203  21.59,46.99 180 bottom
R204  26.67,46.99 180 bottom
R205  38.1,20.32 0 top
R206  38.1,17.78 0 top
R301  52.07,13.34 180 top
R302  27.94,7.62 90 bottom
S301  45.72,10.16 270 top
SV101  4.45,94.61 90 top
SV201  29.21,94.61 0 top
SV202  67.31,94.61 0 top
SV203  5.71,8.26 90 top
SV204  5.71,27.94 90 top

### Tracks (layer width: path | path; a pad name or v marks a point on that pad's centre or on a via)
68681_X1
  Bottom 0.203: R204.2 28.57,45.94 28.57,41.91 29.21,41.27 IC201.36
68681_X2
  Bottom 0.203: IC201.37 26.04,45.09 23.5,45.09 22.44,46.14 R203.2
!68681_CS
  Bottom 0.203: IC201.39 8.89,43.81 6.99,45.72 6.99,57.15 8.26,58.42 23.5,58.42 IC301.14
!68681_DTACK  (via drill 0.35)
  Top 0.203: IC201.10 26.04,27.3 17.78,27.3 v17.14,27.94
  Bottom 0.203: R201.1 5.29,50.8 6.27,50.8 | IC302.11 5.08,59.69 6.27,58.5 6.27,50.8 | 6.27,50.8 6.27,38.81 v17.14,27.94
!68681_IACK
  Bottom 0.203: IC201.41 24.77,40.64 24.13,40.01 8.89,40.01 6.63,42.27 6.63,61.95 6.35,62.23 IC302.10
!68681_IRQ  (via drill 0.35)
  Top 0.203: R202.1 v13.34,46.99 v13.34,43.18
  Bottom 0.203: IC201.24 39.37,36.2 38.1,37.47 27.3,37.47 26.04,38.73 26.04,41.91 25.04,42.9 24.39,42.9 24.11,43.18 v13.34,43.18 | v13.34,46.99 8.89,46.99 7.34,48.54 7.34,55.88 8.61,57.15 IC302.13
!AS
  Top 0.203: IC101.28 76.76,74.85 28.5,74.85 27.3,73.66 20.95,73.66 19.68,72.39 IC301.6
  Bottom 0.203: IC101.28 SV202.33
!BERR  (via drill 0.35)
  Top 0.203: R113.2 IC101.40 48.9,86.36 28.95,86.36 27.6,87.71 10.5,87.71 6.91,84.11 6.91,70.56 9.88,67.59 9.88,67.31 | IC302.17 9.88,67.31 | v10.36,37.72 9.88,38.2 9.88,67.31 | v20.95,16.51 20.95,13.34 21.59,12.7 IC303.14
  Bottom 0.203: SV202.9 IC101.40 | v10.36,37.72 10.36,37.4 10.37,37.39 10.37,36.91 10.36,36.9 10.36,36.63 18.49,28.5 18.49,17.78 19.76,16.51 v20.95,16.51
!BERR_TIMER_CLR  (via drill 0.35)
  Top 0.203: v26.04,88.29 25.81,88.06 10.35,88.06 6.55,84.26 6.55,70.28 9.53,67.31 9.53,37.42 v9.79,37.15 | v18.41,16.51 18.41,15.88 17.78,15.24 IC303.1
  Bottom 0.203: IC301.22 27.03,82.27 27.03,86.51 26.04,87.5 v26.04,88.29 | v9.79,37.15 9.79,36.62 18.14,28.27 18.14,16.79 v18.41,16.51
!BG
  Bottom 0.203: IC101.32 SV202.25
!BR
  Top 0.203: R111.2 IC101.33
  Bottom 0.203: SV202.23 IC101.33
!BUS_CS
  Bottom 0.203: SV201.7 25.4,87.63 26.67,86.36 26.67,83.19 26.04,82.55 IC301.23
!BUS_DTACK
  Bottom 0.203: SV201.6 21.59,94.61 21.59,92.71 20.32,91.44 13.34,91.44 9.8,87.91 9.8,79.02 8.26,77.47 IC302.4
!BUS_IRQ
  Bottom 0.203: SV201.5 22.73,93.34 20.47,91.08 13.61,91.08 10.16,87.63 10.16,76.2 8.89,74.93 IC302.5
!DS
  Bottom 0.203: SV202.31 IC101.29
!DTACK  (via drill 0.35)
  Top 0.203: IC101.31 69.85,75.56 46.54,75.56 45.96,76.15 45.48,76.15 44.9,75.56 29.44,75.56 v29.21,75.79
  Bottom 0.203: SV202.27 IC101.31 | IC302.20 13.97,74.93 15.24,73.66 27.08,73.66 v29.21,75.79
!HALT  (via drill 0.35)
  Top 0.203: R102.1 IC101.36 61.32,79.73 61.32,79.23 59.84,77.75 v28.85,77.75
  Bottom 0.203: SV202.17 IC101.36 | IC302.21 13.34,76.2 27.3,76.2 v28.85,77.75
!IACK
  Bottom 0.203: IC301.19 20.95,68.58 8.26,68.58 6.99,69.85 IC302.7
!IPL0/2
  Top 0.203: IC101.42 44.65,85.52 28.78,85.52 27.3,87 10.79,87 7.62,83.82 7.62,75.56 10.79,72.39 IC302.19
!IPL1
  Top 0.203: IC101.41 50.8,81.96 46.89,85.88 28.93,85.88 27.45,87.35 10.65,87.35 7.26,83.97 7.26,73.38 10.79,69.85 IC302.18
!OE  (via drill 0.35)
  Top 0.203: IC103.24 v73.66,57.78 73.66,48.31 74.57,47.39 74.57,44.05 73.66,43.13 IC102.24 73.66,37.28 74.57,36.37 74.57,23.09 73.66,22.18 IC202.22 | v54.61,57.32 v55.88,57.32
  Bottom 0.203: v54.61,57.32 53.98,57.32 52.89,56.24 36.34,56.24 29.14,63.43 28.93,63.65 26.67,65.91 26.67,68.58 25.4,69.85 IC301.18 | v55.88,57.32 73.2,57.32 v73.66,57.78
!RAM_CS
  Bottom 0.203: IC102.22 78.74,37.47 78.11,36.83 55.24,36.83 54.61,37.47 54.61,40.64 50.16,45.09 50.16,53.34 48.26,55.24 36.2,55.24 26.67,64.77 IC301.16
!REQUIRE_DTACK  (via drill 0.35)
  Top 0.203: v13.97,73.66 19.68,73.66 20.95,74.93 IC301.20
  Bottom 0.203: IC302.6 7.62,72.39 8.89,73.66 v13.97,73.66
!RESET  (via drill 0.35)
  Top 0.203: R101.1 IC101.37 60.96,79.38 59.69,78.11 32.38,78.11 v31.75,78.74 | IC201.38 28.57,42.55 28.57,46.35 31.75,49.53 31.75,70.39 v31.85,70.48
  Bottom 0.203: IC101.37 SV202.15 | v31.85,70.48 31.85,78.64 v31.75,78.74 13.34,78.74 IC302.22
!ROM_CS  (via drill 0.35)
  Top 0.203: v55.88,56.52 v54.61,56.52
  Bottom 0.203: IC103.22 78.74,59.05 76.2,56.52 v55.88,56.52 | v54.61,56.52 53.98,55.88 36.2,55.88 IC301.17
!RTC_CS  (via drill 0.35)
  Top 0.203: v51.39,40.64 51.39,21 v56.52,15.88
  Bottom 0.203: v51.39,40.64 49.81,42.22 49.81,53.06 47.98,54.89 36.05,54.89 28.71,62.23 IC301.15 | v56.52,15.88 78.11,15.88 78.74,16.51 IC202.20
!VPA  (via drill 0.35)
  Top 0.203: R112.2 IC101.39 55.88,79.38 54.97,78.46 32.85,78.46 30.03,81.28 v22.23,81.28
  Bottom 0.203: IC101.39 SV202.11 | v22.23,81.28 13.34,81.28 IC302.23
+5V  (via drill 0.35)
  Top 0.203: R101.2 R102.2 63.5,90.17 | R111.1 71.12,89.53 70.48,90.17 v64.77,90.17 | 57.15,17.78 57.15,15.24 55.24,13.34 R301.1 52.92,15.03 52.07,15.88 40.64,15.88 IC304.4 36.83,13.97 34.92,12.06 34.92,8.26 33.02,6.35 IC304.8 | 53.34,90.17 R113.1 R112.1 | R202.2 v13.34,53.98 | C302.1 IC303.16 22.76,16.61 22.23,17.14 17.78,17.14 16.93,18 R114.1 v15.24,19.05 14.61,18.41 14.61,12.06 15.24,11.43 IC303.4
  Top 0.305: 52.07,49.53 37.47,49.53 Q101.8
  Top 0.406: IC103.32 52.07,59.69 52.07,49.53 52.07,39.37 | IC202.28 57.15,17.78 55.88,17.78 52.07,21.59 52.07,39.37 | v64.77,90.17 63.5,90.17 53.34,90.17 v24.77,90.17 19.05,90.17 17.78,91.44 SV201.1 | v8.26,53.98 v5.08,53.98 | SV203.6 SV203.8 4.45,15.55 C206.1 | v17.78,31.75 v14.61,28.57 | SV204.14 4.45,39.05 C205.1 | IC102.32 52.07,39.37
  Bottom 0.203: C104.1 Q101.8 | R201.2 v5.08,53.98 | C301.1 IC304.8 28.36,6.35 R302.1 | v15.24,19.05 14.61,18.41 1.91,18.41
  Bottom 0.406: IC103.32 C105.1 50.48,57.87 C107.+ | C106.1 IC102.32 | C203.1 IC202.28 | Q101.8 33.02,53.98 v13.34,53.98 v8.26,53.98 | IC101.13 63.5,70.17 C103.1 63.82,74.93 | 63.82,74.93 63.82,79.69 64.77,80.64 v64.77,90.17 | C108.+ 64.05,74.7 63.82,74.93 | SV203.8 3.17,12.06 1.91,13.34 1.91,18.41 1.91,26.67 | 1.91,26.67 1.91,35.56 | 1.91,35.56 1.91,53.98 | v5.08,53.98 1.91,53.98 | SV204.14 1.91,35.56 | v17.78,31.75 IC201.44 C204.1 | v14.61,28.57 12.7,26.67 1.91,26.67 | C208.1 SV201.2 SV201.1 5.71,93.34 | SV101.3 SV101.5 C101.1 | SV101.3 5.71,93.34 | 5.71,93.34 SV101.1 1.91,88.27 | 1.91,53.98 1.91,88.27 | C102.1 SV101.3 | 24.77,87 IC301.24 23.5,83.82 20.32,83.82 | 24.77,87 v24.77,90.17 | 20.32,83.82 13.34,83.82 IC302.24 12.06,87.56 C306.1 | C305.1 22.92,87 24.77,87 | C307.+ 20.32,83.82 | C207.+ 1.91,88.27
A0  (via drill 0.35)
  Top 0.203: IC202.10 81.28,15.83 80.37,16.74 v80.37,20.95 80.37,21.77 81.28,22.68 IC102.12 81.28,36.78 80.37,37.7 80.37,43.35 81.28,44.27 IC103.12 80.37,46.63 80.37,70.76 79.38,71.75 v38.1,71.75
  Bottom 0.203: SV201.17 IC101.46 v38.1,71.75 | IC201.2 23.85,32.03 23.85,25.66 29.13,20.37 72.99,20.37 73.57,20.95 v80.37,20.95
A1  (via drill 0.35)
  Top 0.203: IC202.9 78.74,15.83 77.83,16.74 77.83,18.82 78.74,19.73 v78.74,20.32 IC102.11 78.74,36.78 77.83,37.7 77.83,41.04 78.74,41.96 IC103.11 80.01,46.99 80.01,70.48 79.38,71.12 v35.56,71.12
  Bottom 0.203: SV201.15 IC101.47 v35.56,71.12 | IC201.4 23.5,29.84 23.5,25.4 28.88,20.02 73.13,20.02 73.44,20.32 v78.74,20.32
A2  (via drill 0.35)
  Top 0.203: IC202.8 76.2,15.83 75.29,16.74 v75.29,19.68 75.29,21.77 76.2,22.68 IC102.10 76.2,36.78 75.29,37.7 75.29,43.35 76.2,44.27 IC103.10 76.2,46.99 74.93,48.26 74.93,69.85 74.3,70.48 v33.02,70.48
  Bottom 0.203: SV201.13 IC101.48 v33.02,70.48 | IC201.6 23.14,27.66 23.14,25.25 28.73,19.66 75.26,19.66 v75.29,19.68
A3  (via drill 0.35)
  Top 0.203: IC202.7 73.66,15.83 72.75,16.74 v72.75,20.95 72.75,21.77 73.66,22.68 IC102.9 73.66,36.78 72.75,37.7 72.75,43.35 73.66,44.27 IC103.9 73.66,46.99 72.39,48.26 v72.39,50.8 | IC101.1 35.2,64.49 35.2,62.08 37.39,59.9 37.39,59.26 46.02,50.63 v51.39,50.63 | v54.61,50.63 v55.88,50.63
  Bottom 0.203: SV201.14 34.29,94.61 34.29,67.94 IC101.1 | IC201.7 29.84,20.95 v72.75,20.95 | v51.39,50.63 v54.61,50.63 | v55.88,50.63 72.22,50.63 v72.39,50.8
A4  (via drill 0.35)
  Top 0.203: IC202.6 71.12,15.83 70.21,16.74 70.21,21.77 71.12,22.68 IC102.8 71.12,36.78 70.21,37.7 70.21,43.35 71.12,44.27 IC103.8 71.12,46.99 69.85,48.26 v69.85,51.44 | v54.61,51.44 v55.88,51.44 | v51.39,51.44 45.85,51.44 37.74,59.54 37.74,60.05 35.56,62.23 IC101.2
  Bottom 0.203: SV201.16 36.83,94.61 36.83,67.94 IC101.2 | v51.39,51.44 v54.61,51.44 | v55.88,51.44 v69.85,51.44
A5  (via drill 0.35)
  Top 0.203: IC202.5 68.58,15.83 67.67,16.74 67.67,21.77 68.58,22.68 IC102.7 68.58,36.78 67.67,37.7 67.67,43.35 68.58,44.27 IC103.7 68.58,46.99 67.31,48.26 v67.31,52.07 | IC101.3 38.1,59.69 45.55,52.24 v51.39,52.24 | v54.61,52.24 v55.88,52.24
  Bottom 0.203: SV201.18 39.37,94.61 39.37,67.94 IC101.3 | v51.39,52.24 v54.61,52.24 | v55.88,52.24 56.05,52.07 v67.31,52.07
A6  (via drill 0.35)
  Top 0.203: IC202.4 66.04,15.83 65.13,16.74 65.13,21.77 66.04,22.68 IC102.6 66.04,36.78 65.13,37.7 65.13,43.35 66.04,44.27 IC103.6 66.04,47.62 65.41,48.26 v65.41,53.05 | IC101.4 40.64,57.78 45.38,53.05 v51.39,53.05 | v54.61,53.05 v55.88,53.05
  Bottom 0.203: SV201.20 41.91,94.61 41.91,67.94 IC101.4 | v51.39,53.05 v54.61,53.05 | v55.88,53.05 65.06,53.05 v65.41,53.05
A7  (via drill 0.35)
  Top 0.203: IC202.3 63.5,15.83 62.59,16.74 62.59,21.77 63.5,22.68 IC102.5 63.5,36.78 62.59,37.7 62.59,43.35 63.5,44.27 IC103.5 63.5,46.99 62.23,48.26 v62.23,53.98 | IC101.5 43.18,55.75 45.07,53.86 v51.39,53.86 | v54.61,53.98 v55.88,53.98
  Bottom 0.203: SV202.2 44.45,94.61 44.45,67.94 IC101.5 | v51.39,53.86 51.51,53.98 v54.61,53.98 | v55.88,53.98 v62.23,53.98
A8
  Top 0.203: IC103.27 66.04,48.31 66.95,47.39 66.95,44.05 66.04,43.13 IC102.27 66.04,37.28 66.95,36.37 66.95,23.09 66.04,22.18 IC202.25
  Bottom 0.203: SV202.4 46.99,94.61 46.99,67.94 IC101.6 45.85,66.67 49.38,63.14 63.86,63.14 IC103.27
A9
  Top 0.203: IC103.26 68.58,48.31 69.49,47.39 69.49,44.05 68.58,43.13 IC102.26 68.58,37.28 69.49,36.37 69.49,23.09 68.58,22.18 IC202.24
  Bottom 0.203: SV202.6 49.53,94.61 49.53,67.94 IC101.7 48.26,64.77 49.53,63.5 66.04,63.5 IC103.26
A10
  Top 0.203: IC103.23 76.2,48.31 77.11,47.39 77.11,44.05 76.2,43.13 IC102.23 76.2,37.28 77.11,36.37 77.11,23.09 76.2,22.18 IC202.21
  Bottom 0.203: SV202.8 52.07,94.61 52.07,67.94 IC101.8 50.8,64.14 51.08,63.86 73.3,63.86 IC103.23
A11  (via drill 0.35)
  Top 0.203: IC202.23 71.12,22.18 72.03,23.09 72.03,36.37 71.12,37.28 IC102.25 71.12,43.13 72.03,44.05 72.03,47.39 71.12,48.31 IC103.25 71.12,63.5 v69.85,64.77
  Bottom 0.203: SV202.10 54.61,94.61 54.61,67.94 IC101.9 53.34,64.77 53.9,64.21 69.29,64.21 v69.85,64.77
A12  (via drill 0.35)
  Top 0.203: IC103.4 60.96,41.96 60.05,41.04 60.05,37.7 60.96,36.78 IC102.4 60.96,22.68 60.05,21.77 60.05,16.74 60.96,15.83 IC202.2 | IC101.10 57.15,65.41 v57.15,48.9
  Bottom 0.203: SV202.12 57.15,94.61 57.15,67.94 IC101.10 | IC103.4 60.33,45.72 59.33,46.71 59.33,46.76 58.8,47.3 58.75,47.3 v57.15,48.9
A13
  Top 0.203: IC202.26 63.5,22.18 64.41,23.09 64.41,36.37 63.5,37.28 IC102.28 63.5,43.13 64.41,44.05 64.41,47.39 63.5,48.31 IC103.28 63.5,62.23 62.23,63.5 62.23,67.94 61.59,68.58 59.05,68.58 58.42,67.94 IC101.11
  Bottom 0.203: SV202.14 59.69,94.61 59.69,67.94 IC101.11
A14
  Top 0.203: IC202.1 58.42,15.83 59.33,16.74 59.33,18.82 58.42,19.73 IC102.3 59.69,25.4 59.69,47.04 60.96,48.31 IC103.29 IC101.12
  Bottom 0.203: SV202.16 62.23,94.61 62.23,67.94 IC101.12
A15  (via drill 0.35)
  Top 0.203: IC103.3 58.42,44.27 58.06,43.91 58.06,41.55 IC102.31 | IC101.14 66.04,63.5 64.77,62.23 v64.77,48.26 | v67.31,74.27 67.29,74.3 29.84,74.3 26.67,71.12 20.32,71.12 19.05,69.85 IC301.7
  Bottom 0.203: SV202.20 67.31,94.61 v67.31,74.27 67.31,67.94 IC101.14 | IC103.3 58.42,45.67 60.58,43.51 63.83,43.51 64.77,44.45 v64.77,48.26
A16  (via drill 0.35)
  Top 0.203: IC102.2 55.88,36.78 54.97,37.7 54.97,41.04 55.88,41.96 IC103.2 56.52,46.35 56.52,57.78 54.61,59.69 54.61,68.58 55.24,69.22 70.48,69.22 71.12,68.58 IC101.16 | v72.39,74.27 72.37,74.3 67.94,74.3 67.89,74.24 67.89,74.03 67.55,73.69 67.07,73.69 66.82,73.94 31.39,73.94 26.04,68.58 20.32,68.58 19.05,67.31 IC301.8
  Bottom 0.203: SV202.24 72.39,94.61 v72.39,74.27 72.39,67.94 IC101.16
A17  (via drill 0.35)
  Top 0.203: IC103.30 58.42,48.31 59.33,47.39 59.33,44.05 58.42,43.13 IC102.30 | IC101.17 73.66,64.14 72.39,62.87 v72.39,59.05 | v74.93,74.27 73.21,74.27 72.63,73.69 72.15,73.69 71.9,73.94 68.25,73.94 68.25,73.88 67.7,73.33 66.92,73.33 66.67,73.58 33.66,73.58 33.58,73.58 31.67,73.58 27.3,69.22 27.3,67.31 26.04,66.04 20.32,66.04 19.05,64.77 IC301.9
  Bottom 0.203: SV202.26 74.93,94.61 v74.93,74.27 74.93,67.94 IC101.17 | v72.39,59.05 59.05,59.05 58.42,59.69 IC103.30
A18  (via drill 0.35)
  Top 0.203: IC102.1 53.34,36.78 54.25,37.7 54.25,41.04 53.34,41.96 IC103.1 53.34,46.99 v55.88,49.53 | IC101.18 77.47,65.41 v77.47,50.16 | v77.47,74.3 75.78,74.3 75.17,73.69 74.69,73.69 74.46,73.92 73.36,73.92 72.78,73.33 72,73.33 71.75,73.58 68.5,73.58 67.9,72.98 66.78,72.98 66.53,73.23 31.95,73.23 27.66,68.94 27.66,67.16 26.67,66.17 26.67,64.14 26.04,63.5 20.32,63.5 19.05,62.23 IC301.10
  Bottom 0.203: SV202.28 77.47,94.61 v77.47,74.3 77.47,67.94 IC101.18 | v55.88,49.53 76.83,49.53 v77.47,50.16
A19  (via drill 0.35)
  Top 0.203: v80.01,74.3 78.29,74.3 77.71,73.71 77.23,73.71 77,73.94 75.92,73.94 75.32,73.33 74.54,73.33 74.32,73.56 73.51,73.56 72.92,72.98 71.86,72.98 71.61,73.23 68.65,73.23 68.05,72.62 66.63,72.62 66.38,72.87 32.1,72.87 28.02,68.79 28.02,67.02 27.17,66.17 27.17,62.1 26.04,60.96 20.32,60.96 19.05,59.69 IC301.11
  Bottom 0.203: SV202.30 80.01,94.61 v80.01,74.3 80.01,67.94 IC101.19
CLK  (via drill 0.35)
  Top 0.203: IC101.34 63.5,76.83 v31.11,76.83 28.57,76.83 26.67,78.74 22.23,78.74 19.68,76.2 15.24,76.2 14.61,76.83 14.61,83.82 | IC301.1 15.24,85.09 14.61,84.45 14.61,83.82 | v8.98,83.73 9.08,83.82 14.61,83.82
  Bottom 0.203: IC101.34 SV202.21 | v31.11,76.83 30.48,76.2 30.48,64.14 Q101.5 | IC302.1 7.62,85.09 v8.98,83.73
D0  (via drill 0.35)
  Top 0.203: IC202.11 83.82,15.83 82.91,16.74 82.91,21.77 83.82,22.68 IC102.13 v83.82,33.66 83.82,36.78 82.91,37.7 82.91,43.35 83.82,44.27 IC103.13 83.82,46.99 82.55,48.26 82.55,69.22 85.72,72.39 85.72,75.56 86.36,76.2 IC101.27
  Bottom 0.203: R103.2 IC101.27 SV202.35 | IC201.28 47.62,33.66 v83.82,33.66
D1  (via drill 0.35)
  Top 0.203: IC202.12 86.36,15.83 85.45,16.74 85.45,21.77 86.36,22.68 IC102.14 v86.36,28.57 86.36,36.78 85.45,37.7 85.45,43.35 86.36,44.27 IC103.14 86.36,46.99 85.09,48.26 85.09,67.94 88.27,71.12 88.27,75.56 88.9,76.2 IC101.26
  Bottom 0.203: R104.2 IC101.26 SV202.37 | IC201.18 v86.36,28.57
D2  (via drill 0.35)
  Top 0.203: IC202.13 88.9,15.83 87.99,16.74 87.99,21.77 88.9,22.68 IC102.15 v88.9,32.38 88.9,36.78 87.99,37.7 87.99,43.35 88.9,44.27 IC103.15 88.9,46.54 87.99,47.45 87.99,68.35 91.44,71.8 IC101.25
  Bottom 0.203: R105.2 IC101.25 SV202.39 | IC201.27 38.73,37.47 40.64,37.47 45.72,32.38 v88.9,32.38
D3  (via drill 0.35)
  Top 0.203: IC202.15 91.44,22.18 92.35,23.09 92.35,25.17 91.44,26.08 v91.44,29.21 IC102.17 91.44,43.13 92.35,44.05 92.35,47.39 91.44,48.31 IC103.17 IC101.24 92.71,67.94 92.71,94.61 SV202.40
  Bottom 0.203: R106.2 IC101.24 | v91.44,29.21 40.66,29.21 40.38,29.49 38.38,29.49 IC201.19
D4  (via drill 0.35)
  Top 0.203: IC202.16 88.9,22.18 89.81,23.09 v89.81,33.02 89.81,36.37 88.9,37.28 IC102.18 88.9,43.13 89.81,44.05 89.81,47.39 88.9,48.31 IC103.18 IC101.23
  Bottom 0.203: IC101.23 R107.2 89.95,70.91 90.17,71.12 90.17,94.61 SV202.38 | IC201.26 45.72,33.02 v89.81,33.02
D5  (via drill 0.35)
  Top 0.203: IC202.17 86.36,22.18 87.27,23.09 v87.27,31.11 87.27,36.37 86.36,37.28 IC102.19 86.36,43.13 87.27,44.05 87.27,47.39 86.36,48.31 IC103.19 IC101.22
  Bottom 0.203: IC101.22 R108.2 87.42,70.91 87.63,71.12 87.63,94.61 SV202.36 | IC201.20 v87.27,31.11
D6  (via drill 0.35)
  Top 0.203: IC202.18 83.82,22.18 84.73,23.09 v84.73,31.75 84.73,36.37 83.82,37.28 IC102.20 83.82,43.13 84.73,44.05 84.73,47.39 83.82,48.31 IC103.20 IC101.21
  Bottom 0.203: IC101.21 R109.2 84.88,70.91 85.09,71.12 85.09,94.61 SV202.34 | IC201.25 38.71,36.2 39.63,35.28 40.28,35.28 43.81,31.75 v84.73,31.75
D7  (via drill 0.35)
  Top 0.203: IC202.19 81.28,22.18 82.19,23.09 v82.19,30.48 82.19,36.37 81.28,37.28 IC102.21 81.28,43.13 82.19,44.05 82.19,47.39 81.28,48.31 IC103.21 IC101.20
  Bottom 0.203: IC101.20 R110.2 82.33,70.91 82.55,71.12 82.55,94.61 SV202.32 | IC201.21 38.71,31.11 39.63,30.2 40.38,30.2 40.66,30.48 v82.19,30.48
E  (via drill 0.35)
  Top 0.203: SV202.13 58.42,91.44 57.78,90.81 21.64,90.81 v21.59,90.85 | v16.68,88.64 10.43,88.64 6.2,84.41 6.2,70 9.17,67.03 9.17,37.11 v8.98,36.92 | IC303.9 20.95,6.35 20.32,6.99 v20.32,11.43
  Bottom 0.203: SV202.13 IC101.38 | v21.59,90.85 21.47,90.73 17.78,90.73 17.09,90.04 17.09,89.29 16.68,88.89 v16.68,88.64 | v8.98,36.92 17.78,28.13 17.78,15.24 20.32,12.7 v20.32,11.43
FC0
  Top 0.203: IC101.45 40.64,83.82 40.01,84.45 27.3,84.45 26.67,83.82 21.33,83.82 20.68,83.17 20.68,79.1 19.05,77.47 IC301.4
  Bottom 0.203: IC101.45 SV201.19
FC1
  Top 0.203: IC101.44 43.18,83.82 42.19,84.81 28.48,84.81 27.01,86.28 23.29,86.28 20.32,83.32 20.32,81.28 19.05,80.01 IC301.3
  Bottom 0.203: SV202.1 IC101.44
FC2
  Top 0.203: IC101.43 42.47,85.17 28.63,85.17 27.16,86.64 23.14,86.64 20.32,83.82 20,83.5 19.05,82.55 IC301.2
  Bottom 0.203: IC101.43 SV202.3
GND  (via drill 0.35)
  other vias: 0.64,0.64 0.64,3.81 0.64,6.99 0.64,16.51 0.64,10.16 0.64,13.34 16.51,0.64 13.34,0.64 10.16,0.64 6.99,0.64 3.81,0.64 35.56,0.64 32.38,0.64 29.21,0.64 19.68,0.64 26.04,0.64 22.86,0.64 54.61,0.64 51.44,0.64 48.26,0.64 38.73,0.64 45.09,0.64 41.91,0.64 0.64,38.73 0.64,41.91 0.64,45.09 0.64,54.61 0.64,48.26 0.64,51.44 0.64,19.68 0.64,22.86 0.64,26.04 0.64,35.56 0.64,29.21 0.64,32.38 0.64,57.78 0.64,60.96 0.64,64.14 0.64,73.66 0.64,67.31 0.64,70.48 0.64,76.83 0.64,80.01 0.64,83.19 0.64,92.71 0.64,86.36 0.64,89.53 0.64,95.89 0.64,99.06 19.68,99.06 16.51,99.06 13.34,99.06 3.81,99.06 10.16,99.06 6.99,99.06 38.73,99.06 35.56,99.06 32.38,99.06 22.86,99.06 29.21,99.06 26.04,99.06 41.91,99.06 45.09,99.06 48.26,99.06 57.78,99.06 51.44,99.06 54.61,99.06 76.83,99.06 73.66,99.06 70.48,99.06 60.96,99.06 67.31,99.06 64.14,99.06 95.89,99.06 92.71,99.06 89.53,99.06 80.01,99.06 86.36,99.06 83.19,99.06 95.89,80.01 95.89,83.19 95.89,86.36 95.89,95.89 95.89,89.53 95.89,92.71 95.89,60.96 95.89,64.14 95.89,67.31 95.89,76.83 95.89,70.48 95.89,73.66 95.89,41.91 95.89,45.09 95.89,48.26 95.89,57.78 95.89,51.44 95.89,54.61 95.89,22.86 95.89,26.04 95.89,29.21 95.89,38.73 95.89,32.38 95.89,35.56 95.89,3.81 95.89,6.99 95.89,10.16 95.89,19.68 95.89,13.34 95.89,16.51 95.89,0.64 92.71,0.64 89.53,0.64 86.36,0.64 76.83,0.64 83.19,0.64 80.01,0.64 73.66,0.64 70.48,0.64 67.31,0.64 57.78,0.64 64.14,0.64 60.96,0.64 53.34,69.22 53.34,79.38 45.72,79.38 69.85,79.38 46.99,39.37 46.99,60.96 54.61,55.24 69.85,55.24 67.31,55.24 62.23,55.24 72.39,55.24 78.74,55.24 90.17,55.24 83.82,74.3 81.28,74.3 86.36,74.3 88.9,74.3 57.78,35.56 56.52,35.56 59.05,35.56 59.05,27.3 57.78,27.3 56.52,27.3 54.61,27.3 54.61,35.56 80.01,35.56 80.01,27.3 58.42,79.38 10.16,92.08 15.24,36.2 15.24,33.66 17.78,33.66 46.99,17.78 52.07,17.78 45.72,57.78 73.66,69.22 76.2,69.22 78.74,69.22 46.99,64.14 85.72,88.27 87,88.27 88.27,88.27 89.53,88.27 90.81,88.27 53.34,58.42 10.16,90.17 16.51,89.53 23.5,91.44
  pour Top: 0,0 0,100 96.83,100 96.83,0
  pour Bottom: 0,0 0,100 96.83,100 96.83,0
IO_IN0
  Top 0.203: IC201.40 21.63,40.68 14.14,40.68 7.75,34.29 5.71,34.29 SV204.12
IO_IN1
  Top 0.203: IC201.42 15.24,38.73 8.26,31.75 8.26,29.84 7.62,29.21 5.71,29.21 SV204.10
IO_IN2  (via drill 0.35)
  Top 0.203: v11.97,36.92 v9.43,34.38
  Bottom 0.203: IC201.43 23.5,37.47 12.7,37.47 12.06,36.83 v11.97,36.92 | v9.43,34.38 8.26,33.21 8.26,29.84 7.62,29.21 5.71,29.21 SV204.8
IO_IN3
  Top 0.203: IC201.3 23.5,34.92 12.94,34.92 9.64,31.63 9.6,31.59 9.6,26.58 7.41,24.38 6.56,24.38 5.55,25.4 SV204.6
IO_IN4
  Top 0.203: IC201.5 23.5,32.38 10.9,32.38 9.96,31.44 9.96,26.43 7.55,24.03 5.61,24.03 SV204.4
IO_IN5  (via drill 0.35)
  Top 0.203: IC201.8 23.5,29.84 17.14,29.84 v15.24,27.94
  Bottom 0.203: SV204.2 5.71,21.59 5.71,23.5 6.35,24.05 11.43,24.05 v15.24,27.94
IO_OUT0
  Top 0.203: IC201.31 33.66,42.55 33.66,40.64 33.34,40.32 14.29,40.32 8.57,34.61 SV204.11
IO_OUT1
  Top 0.203: IC201.32 33.62,39.97 15.84,39.97 6.99,31.11 SV204.9
IO_OUT2
  Top 0.203: IC201.29 36.2,42.55 36.2,40.64 34.92,39.37 27.3,39.37 25.76,37.82 14.83,37.82 8.89,31.88 8.89,29.84 SV204.7
IO_OUT3
  Top 0.203: SV204.5 7.34,25.4 9.25,27.3 9.25,31.73 14.98,37.47 26.04,37.47 27.58,39.01 35.07,39.01 37.33,41.27 IC201.30
IO_OUT4
  Top 0.203: IC201.14 31.47,27.66 27.03,27.66 26.04,26.67 26.04,24.13 24.77,22.86 SV204.3
IO_OUT5
  Top 0.203: SV204.1 9.17,22.5 24.91,22.5 26.39,23.98 26.39,26.52 27.17,27.3 33.04,27.3 34.31,28.57 IC201.16
N$1
  Top 0.203: R301.2 48.06,13.34 S301.1 47.98,8.89 | 47.98,8.89 S301.2 48.06,6.99 C303.1 | IC304.2 47.98,8.89
N$2
  Bottom 0.203: R204.1 25.91,47.08 Q201.1 C202.2
N$3
  Bottom 0.203: R203.1 21.08,47.33 Q201.2 C201.2
N$4
  Top 0.203: LED101.A R114.2
N$5
  Top 0.203: IC303.2 17.78,13.97 18.41,13.34 18.41,10.79 17.78,10.16 IC303.5
N$6  (via drill 0.35)
  Top 0.203: IC303.12 21.59,10.16 20.95,9.53 v20.95,7.62 | v18.41,7.62 IC303.7
  Bottom 0.203: v20.95,7.62 v18.41,7.62
N$7
  Top 0.203: R205.2 LED201.A
N$8
  Top 0.203: IC303.13 24.13,11.43 24.77,10.79 24.77,8.26 24.13,7.62 IC303.10
N$9
  Top 0.203: LED202.A R206.2
N$12
  Top 0.203: IC304.6 IC304.7
  Bottom 0.203: C304.1 27.84,8.57 R302.2 28.36,8.89 IC304.7
R/!W!  (via drill 0.35)
  Top 0.203: IC102.29 60.96,37.28 61.87,36.37 61.87,23.09 60.96,22.18 v60.96,21.59 IC202.27 | IC101.30 72.03,75.21 45.72,75.21 | 45.72,75.21 28.93,75.21 27.94,76.2 20.95,76.2 19.68,74.93 IC301.5 | 45.72,75.21 v45.72,75.56
  Bottom 0.203: IC102.29 57.15,43.18 57.15,46.99 55.24,48.9 55.24,60.33 IC103.31 55.88,62.23 55.32,62.79 47.07,62.79 44.45,65.41 44.45,67.44 44.81,67.8 44.81,68.3 45.72,69.22 v45.72,75.56 | IC101.30 SV202.29 | IC201.9 31.75,21.59 v60.96,21.59
RESET  (via drill 0.35)
  Top 0.203: v3.76,13.97 2.54,15.19 2.54,52.7 6.35,56.52 6.35,64.14 5.71,64.77 IC302.9
  Bottom 0.203: v3.76,13.97 7.62,13.97 11.43,10.16 37.47,10.16 IC304.3
STATUS0
  Top 0.203: IC201.15 34.92,19.05 36.2,17.78 R206.1
STATUS1
  Top 0.203: IC201.17 37.47,20.54 R205.1
UART0_RX  (via drill 0.35)
  Top 0.203: v31.11,38.1 v31.11,36.83 | v31.11,24.13 29.21,24.13 28.93,23.85 28.67,23.85 26.25,21.44 9.74,21.44 8.97,20.66 8.97,7.53 7.41,5.97 7.24,5.97 6.99,5.71 5.71,5.71 SV203.2
  Bottom 0.203: IC201.35 31.11,42.55 v31.11,38.1 | v31.11,36.83 v31.11,24.13
UART0_TX  (via drill 0.35)
  Top 0.203: v33.66,38.1 v33.66,36.83 | v33.66,24.13 33.02,23.5 28.81,23.5 26.4,21.08 9.89,21.08 9.32,20.51 9.32,7.38 6.99,5.04 SV203.1
  Bottom 0.203: IC201.33 33.66,42.55 v33.66,38.1 | v33.66,36.83 v33.66,24.13
UART1_RX
  Top 0.203: SV203.4 5.71,8.26 7.62,8.26 8.26,8.89 8.26,20.95 9.45,22.15 25.96,22.15 IC201.11
UART1_TX
  Top 0.203: IC201.13 31.11,24.77 29.21,24.77 28.93,24.49 28.8,24.49 26.11,21.79 9.6,21.79 8.61,20.81 8.61,8.74 6.99,7.12 SV203.3

### Text on the board
tNames: 5V In | http://tseifert.me/68komputer | 68komputer-008 | Rev 01 | GPIO | UART | Reset | (c) 2019 Tristan Seifert